# Altium project RFSoC-AMC.PrjPCB (part 5 of 22)

## Sheet RTM_Connector.SchDoc: RFSoC AMC
size 420 x 297 mm; CompanyName: WUT; DrawnBy: T. Przywozki; Organization: WUT ISE; Address1: Warsaw University of Technology; Address2: Nowowiejska 15/19 00-665 Warsaw; Address3: Tomasz.Przywozki@pw.edu.pl; DocumentNumber: 26; Revision: 1; SheetNumber: 26; SheetTotal: 45; Project: RFSoC AMC; ModifiedBy: T. Przywozki; CreateDate: -; CheckedDate: -; DivGrp: ISE; Designer: T. Przywozki; ModifiedDate: -; ProjectName: ADC/DAC MEZZANINE
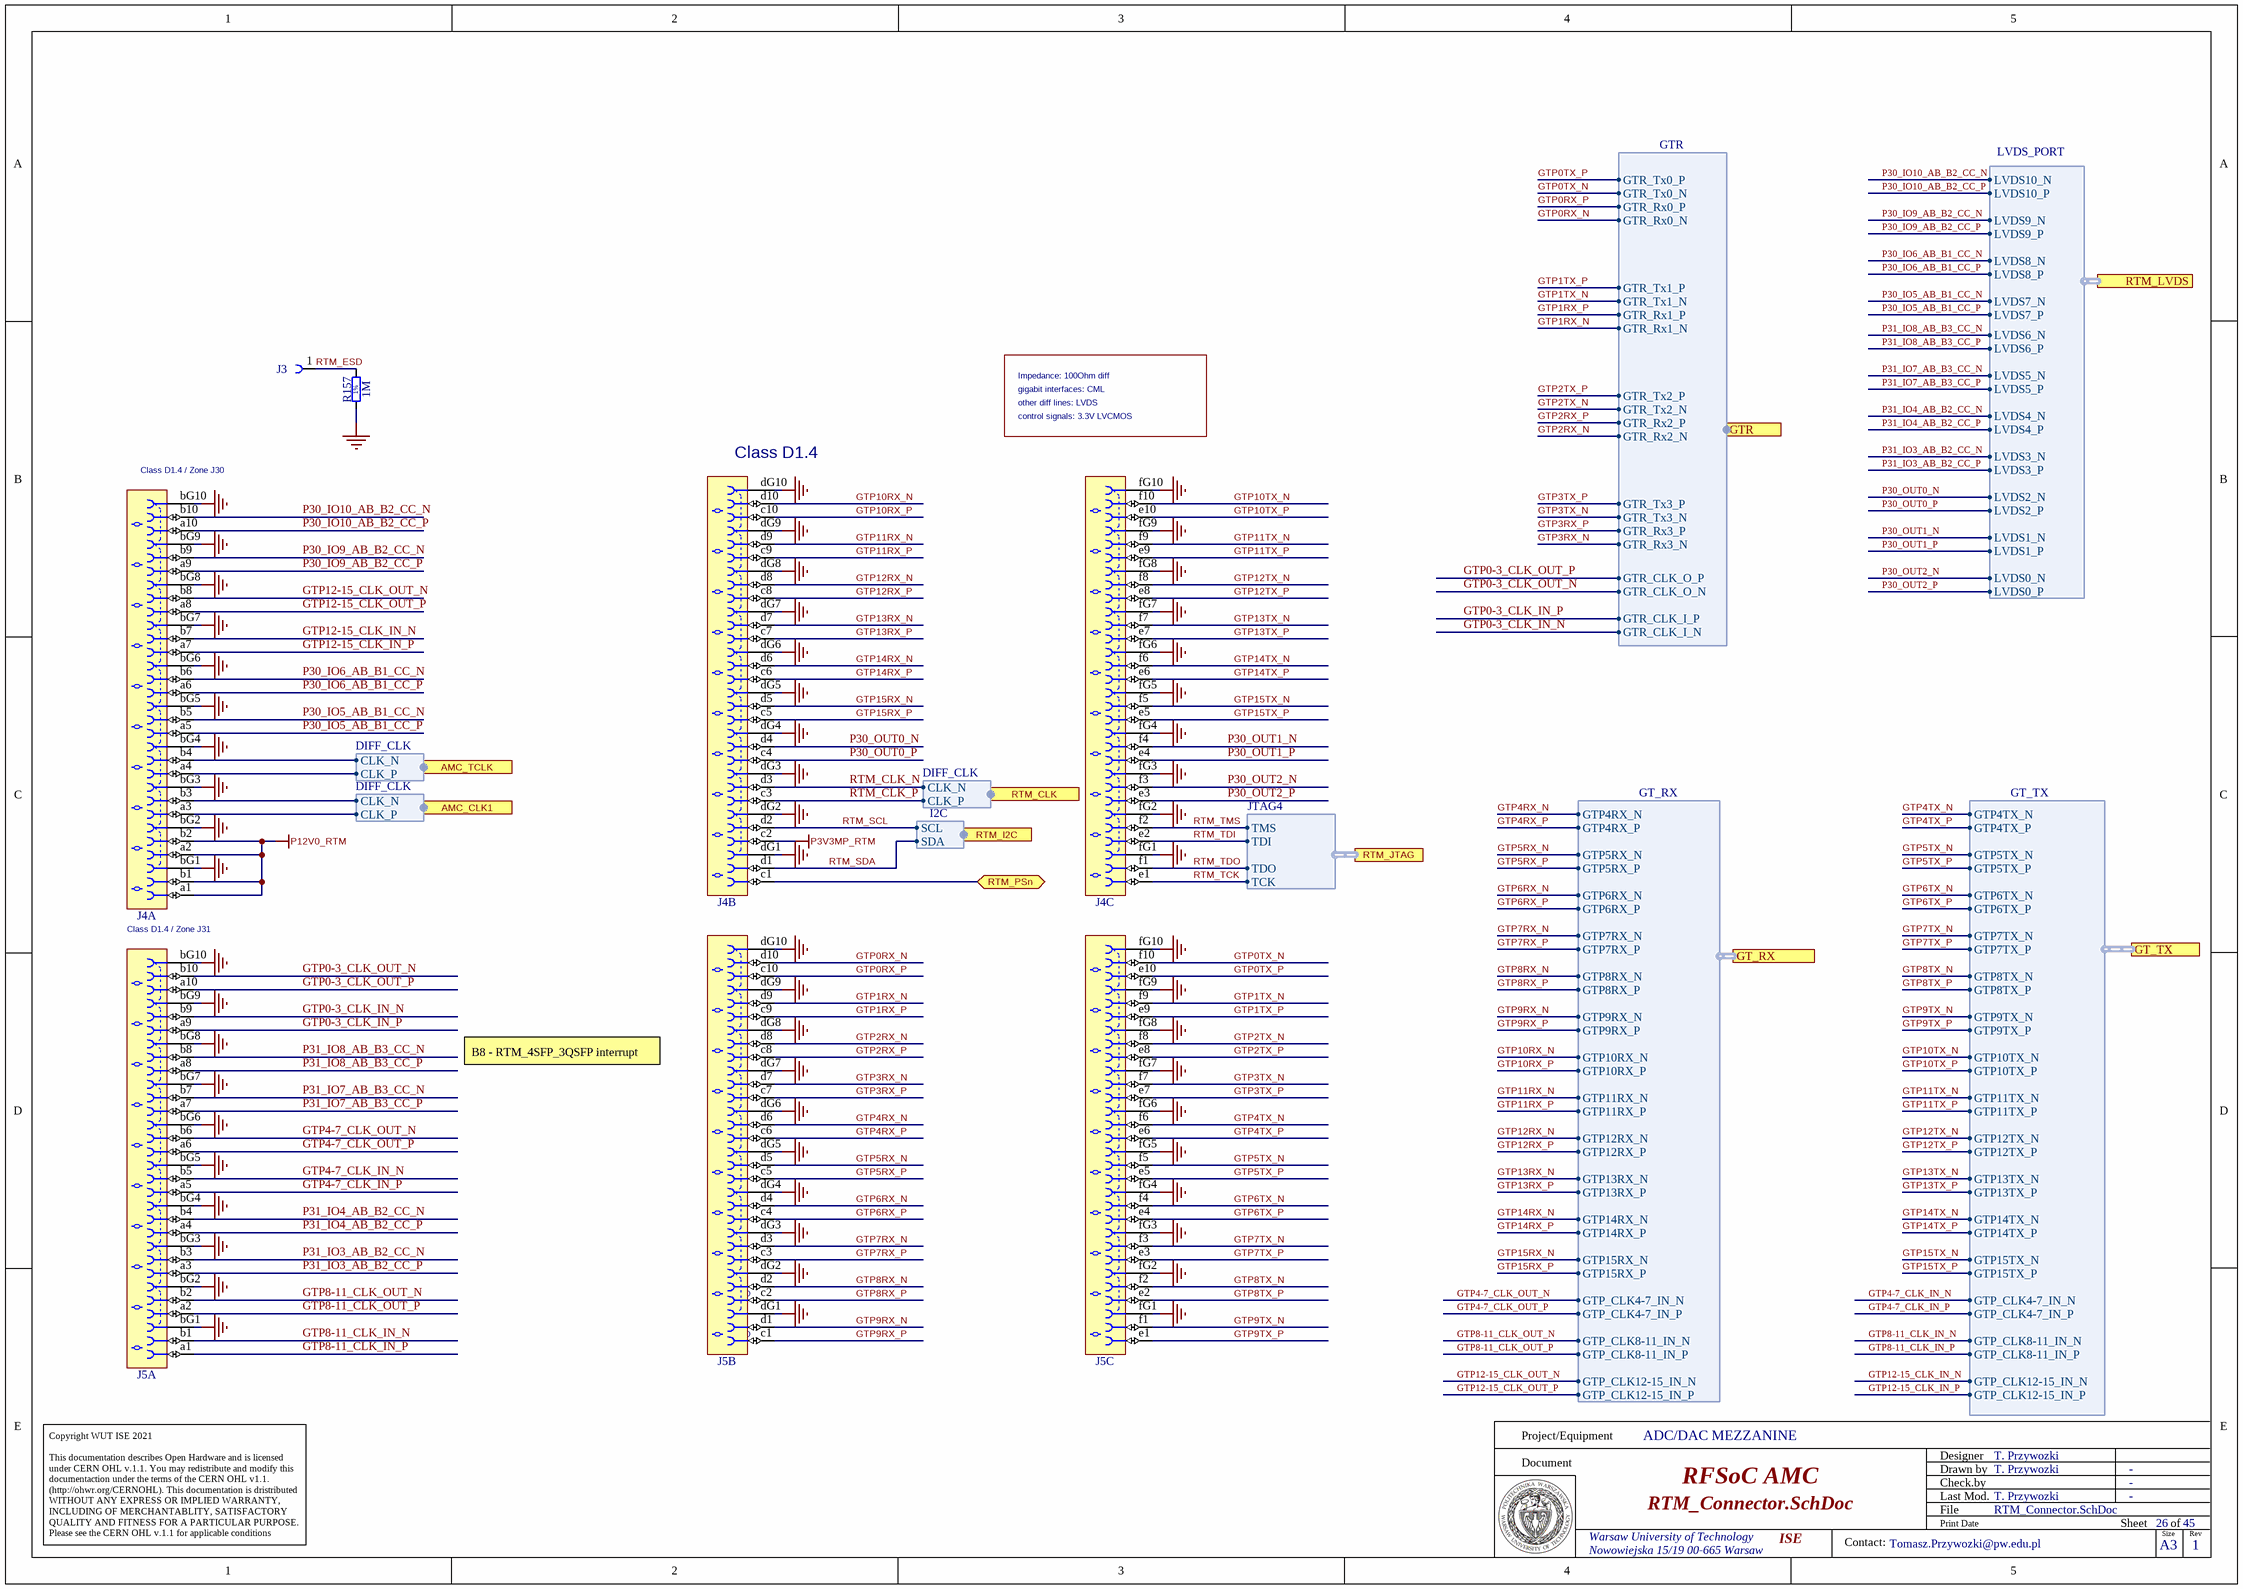
[diagram p9: RTM_Connector.SchDoc]

### Parts
J3  (no value)  [TYCO_5120913-1]
J4  Advanced TCA  [TYCO_6469081-1]  (value not drawn)  (parts A,B,C of 3)
J5  Advanced TCA  [TYCO_6469081-1]  (value not drawn)  (parts A,B,C of 3)
R157  1M  [RESC5025X65N]

### Ports
AMC_CLK1 (harness DIFF_CLK), AMC_TCLK (harness DIFF_CLK), GT_RX (harness GT_RX), GT_TX (harness GT_TX), GTR (harness GTR), RTM_CLK (harness DIFF_CLK), RTM_I2C (harness I2C), RTM_JTAG (harness JTAG4), RTM_LVDS (harness LVDS_PORT), RTM_PSn (bidir)

### Harnesses
LVDS_PORT: LVDS0_P, LVDS0_N, LVDS1_P, LVDS1_N, LVDS2_P, LVDS2_N, LVDS3_P, LVDS3_N, LVDS4_P, LVDS4_N, LVDS5_P, LVDS5_N, LVDS6_P, LVDS6_N, LVDS7_P, LVDS7_N, LVDS8_P, LVDS8_N, LVDS9_P, LVDS9_N, LVDS10_P, LVDS10_N
GT_RX: GTP4RX_P, GTP5RX_N, GTP4RX_N, GTP5RX_P, GTP6RX_N, GTP6RX_P, GTP7RX_N, GTP7RX_P, GTP8RX_N, GTP8RX_P, GTP9RX_N, GTP9RX_P, GTP10RX_N, GTP10RX_P, GTP11RX_N, GTP11RX_P, GTP12RX_N, GTP12RX_P, GTP13RX_N, GTP13RX_P, GTP14RX_N, GTP14RX_P, GTP15RX_N, GTP15RX_P, GTP_CLK4-7_IN_N, GTP_CLK8-11_IN_N, GTP_CLK4-7_IN_P, GTP_CLK8-11_IN_P, GTP_CLK12-15_IN_N, GTP_CLK12-15_IN_P
GT_TX: GTP4TX_N, GTP4TX_P, GTP5TX_N, GTP5TX_P, GTP6TX_N, GTP6TX_P, GTP7TX_N, GTP7TX_P, GTP8TX_N, GTP8TX_P, GTP9TX_N, GTP9TX_P, GTP10TX_N, GTP10TX_P, GTP11TX_N, GTP11TX_P, GTP12TX_N, GTP12TX_P, GTP13TX_N, GTP13TX_P, GTP14TX_N, GTP14TX_P, GTP15TX_N, GTP15TX_P, GTP_CLK4-7_IN_N, GTP_CLK8-11_IN_N, GTP_CLK4-7_IN_P, GTP_CLK8-11_IN_P, GTP_CLK12-15_IN_N, GTP_CLK12-15_IN_P
JTAG4: TMS, TDI, TDO, TCK
I2C: SCL, SDA
DIFF_CLK: CLK_P, CLK_N
GTR: GTR_Tx0_P, GTR_Tx0_N, GTR_Rx0_P, GTR_Rx0_N, GTR_Rx1_P, GTR_Rx1_N, GTR_Tx1_P, GTR_Tx1_N, GTR_Rx2_P, GTR_Rx2_N, GTR_Tx2_P, GTR_Tx2_N, GTR_Rx3_P, GTR_Rx3_N, GTR_Tx3_P, GTR_Tx3_N, GTR_CLK_O_P, GTR_CLK_O_N, GTR_CLK_I_P, GTR_CLK_I_N

### Nets
GND: J4.bG1 J4.bG2 J4.bG3 J4.bG4 J4.bG5 J4.bG6 J4.bG7 J4.bG8 J4.bG9 J4.bG10 J4.dG1 J4.dG2 J4.dG3 J4.dG4 J4.dG5 J4.dG6 J4.dG7 J4.dG8 J4.dG9 J4.dG10 J4.fG1 J4.fG2 J4.fG3 J4.fG4 J4.fG5 J4.fG6 J4.fG7 J4.fG8 J4.fG9 J4.fG10 J5.bG1 J5.bG2 J5.bG3 J5.bG4 J5.bG5 J5.bG6 J5.bG7 J5.bG8 J5.bG9 J5.bG10 J5.dG1 J5.dG2 J5.dG3 J5.dG4 J5.dG5 J5.dG6 J5.dG7 J5.dG8 J5.dG9 J5.dG10 J5.fG1 J5.fG2 J5.fG3 J5.fG4 J5.fG5 J5.fG6 J5.fG7 J5.fG8 J5.fG9 J5.fG10 R157.1
P3V3MP_RTM: J4.c2
P12V0_RTM: J4.a1 J4.a2 J4.b1 J4.b2
AMC_CLK_N: J4.b3 ; port AMC_CLK1.CLK_N
AMC_CLK_P: J4.a3 ; port AMC_CLK1.CLK_P
AMC_TCLKA_N: J4.b4 ; port AMC_TCLK.CLK_N
AMC_TCLKA_P: J4.a4 ; port AMC_TCLK.CLK_P
GTP0-3_CLK_IN_N: J5.b9 ; port GTR.GTR_CLK_I_N
GTP0-3_CLK_IN_P: J5.a9 ; port GTR.GTR_CLK_I_P
GTP0-3_CLK_OUT_N: J5.b10 ; port GTR.GTR_CLK_O_N
GTP0-3_CLK_OUT_P: J5.a10 ; port GTR.GTR_CLK_O_P
GTP0RX_N: J5.d10 ; port GTR.GTR_Rx0_N
GTP0RX_P: J5.c10 ; port GTR.GTR_Rx0_P
GTP0TX_N: J5.f10 ; port GTR.GTR_Tx0_N
GTP0TX_P: J5.e10 ; port GTR.GTR_Tx0_P
GTP1RX_N: J5.d9 ; port GTR.GTR_Rx1_N
GTP1RX_P: J5.c9 ; port GTR.GTR_Rx1_P
GTP1TX_N: J5.f9 ; port GTR.GTR_Tx1_N
GTP1TX_P: J5.e9 ; port GTR.GTR_Tx1_P
GTP2RX_N: J5.d8 ; port GTR.GTR_Rx2_N
GTP2RX_P: J5.c8 ; port GTR.GTR_Rx2_P
GTP2TX_N: J5.f8 ; port GTR.GTR_Tx2_N
GTP2TX_P: J5.e8 ; port GTR.GTR_Tx2_P
GTP3RX_N: J5.d7 ; port GTR.GTR_Rx3_N
GTP3RX_P: J5.c7 ; port GTR.GTR_Rx3_P
GTP3TX_N: J5.f7 ; port GTR.GTR_Tx3_N
GTP3TX_P: J5.e7 ; port GTR.GTR_Tx3_P
GTP4-7_CLK_IN_N: J5.b5 ; port GT_TX.GTP_CLK4-7_IN_N
GTP4-7_CLK_IN_P: J5.a5 ; port GT_TX.GTP_CLK4-7_IN_P
GTP4-7_CLK_OUT_N: J5.b6 ; port GT_RX.GTP_CLK4-7_IN_N
GTP4-7_CLK_OUT_P: J5.a6 ; port GT_RX.GTP_CLK4-7_IN_P
GTP4RX_N: J5.d6 ; port GT_RX.GTP4RX_N
GTP4RX_P: J5.c6 ; port GT_RX.GTP4RX_P
GTP4TX_N: J5.f6 ; port GT_TX.GTP4TX_N
GTP4TX_P: J5.e6 ; port GT_TX.GTP4TX_P
GTP5RX_N: J5.d5 ; port GT_RX.GTP5RX_N
GTP5RX_P: J5.c5 ; port GT_RX.GTP5RX_P
GTP5TX_N: J5.f5 ; port GT_TX.GTP5TX_N
GTP5TX_P: J5.e5 ; port GT_TX.GTP5TX_P
GTP6RX_N: J5.d4 ; port GT_RX.GTP6RX_N
GTP6RX_P: J5.c4 ; port GT_RX.GTP6RX_P
GTP6TX_N: J5.f4 ; port GT_TX.GTP6TX_N
GTP6TX_P: J5.e4 ; port GT_TX.GTP6TX_P
GTP7RX_N: J5.d3 ; port GT_RX.GTP7RX_N
GTP7RX_P: J5.c3 ; port GT_RX.GTP7RX_P
GTP7TX_N: J5.f3 ; port GT_TX.GTP7TX_N
GTP7TX_P: J5.e3 ; port GT_TX.GTP7TX_P
GTP8-11_CLK_IN_N: J5.b1 ; port GT_TX.GTP_CLK8-11_IN_N
GTP8-11_CLK_IN_P: J5.a1 ; port GT_TX.GTP_CLK8-11_IN_P
GTP8-11_CLK_OUT_N: J5.b2 ; port GT_RX.GTP_CLK8-11_IN_N
GTP8-11_CLK_OUT_P: J5.a2 ; port GT_RX.GTP_CLK8-11_IN_P
GTP8RX_N: J5.d2 ; port GT_RX.GTP8RX_N
GTP8RX_P: J5.c2 ; port GT_RX.GTP8RX_P
GTP8TX_N: J5.f2 ; port GT_TX.GTP8TX_N
GTP8TX_P: J5.e2 ; port GT_TX.GTP8TX_P
GTP9RX_N: J5.d1 ; port GT_RX.GTP9RX_N
GTP9RX_P: J5.c1 ; port GT_RX.GTP9RX_P
GTP9TX_N: J5.f1 ; port GT_TX.GTP9TX_N
GTP9TX_P: J5.e1 ; port GT_TX.GTP9TX_P
GTP10RX_N: J4.d10 ; port GT_RX.GTP10RX_N
GTP10RX_P: J4.c10 ; port GT_RX.GTP10RX_P
GTP10TX_N: J4.f10 ; port GT_TX.GTP10TX_N
GTP10TX_P: J4.e10 ; port GT_TX.GTP10TX_P
GTP11RX_N: J4.d9 ; port GT_RX.GTP11RX_N
GTP11RX_P: J4.c9 ; port GT_RX.GTP11RX_P
GTP11TX_N: J4.f9 ; port GT_TX.GTP11TX_N
GTP11TX_P: J4.e9 ; port GT_TX.GTP11TX_P
GTP12-15_CLK_IN_N: J4.b7 ; port GT_TX.GTP_CLK12-15_IN_N
GTP12-15_CLK_IN_P: J4.a7 ; port GT_TX.GTP_CLK12-15_IN_P
GTP12-15_CLK_OUT_N: J4.b8 ; port GT_RX.GTP_CLK12-15_IN_N
GTP12-15_CLK_OUT_P: J4.a8 ; port GT_RX.GTP_CLK12-15_IN_P
GTP12RX_N: J4.d8 ; port GT_RX.GTP12RX_N
GTP12RX_P: J4.c8 ; port GT_RX.GTP12RX_P
GTP12TX_N: J4.f8 ; port GT_TX.GTP12TX_N
GTP12TX_P: J4.e8 ; port GT_TX.GTP12TX_P
GTP13RX_N: J4.d7 ; port GT_RX.GTP13RX_N
GTP13RX_P: J4.c7 ; port GT_RX.GTP13RX_P
GTP13TX_N: J4.f7 ; port GT_TX.GTP13TX_N
GTP13TX_P: J4.e7 ; port GT_TX.GTP13TX_P
GTP14RX_N: J4.d6 ; port GT_RX.GTP14RX_N
GTP14RX_P: J4.c6 ; port GT_RX.GTP14RX_P
GTP14TX_N: J4.f6 ; port GT_TX.GTP14TX_N
GTP14TX_P: J4.e6 ; port GT_TX.GTP14TX_P
GTP15RX_N: J4.d5 ; port GT_RX.GTP15RX_N
GTP15RX_P: J4.c5 ; port GT_RX.GTP15RX_P
GTP15TX_N: J4.f5 ; port GT_TX.GTP15TX_N
GTP15TX_P: J4.e5 ; port GT_TX.GTP15TX_P
P30_IO5_AB_B1_CC_N: J4.b5 ; port RTM_LVDS.LVDS7_N  [project net LVDS7_N]
P30_IO5_AB_B1_CC_P: J4.a5 ; port RTM_LVDS.LVDS7_P  [project net LVDS7_P]
P30_IO6_AB_B1_CC_N: J4.b6 ; port RTM_LVDS.LVDS8_N  [project net LVDS8_N]
P30_IO6_AB_B1_CC_P: J4.a6 ; port RTM_LVDS.LVDS8_P  [project net LVDS8_P]
P30_IO9_AB_B2_CC_N: J4.b9 ; port RTM_LVDS.LVDS9_N  [project net LVDS9_N]
P30_IO9_AB_B2_CC_P: J4.a9 ; port RTM_LVDS.LVDS9_P  [project net LVDS9_P]
P30_IO10_AB_B2_CC_N: J4.b10 ; port RTM_LVDS.LVDS10_N  [project net LVDS10_N]
P30_IO10_AB_B2_CC_P: J4.a10 ; port RTM_LVDS.LVDS10_P  [project net LVDS10_P]
P30_OUT0_N: J4.d4 ; port RTM_LVDS.LVDS2_N  [project net LVDS2_N]
P30_OUT0_P: J4.c4 ; port RTM_LVDS.LVDS2_P  [project net LVDS2_P]
P30_OUT1_N: J4.f4 ; port RTM_LVDS.LVDS1_N  [project net LVDS1_N]
P30_OUT1_P: J4.e4 ; port RTM_LVDS.LVDS1_P  [project net LVDS1_P]
P30_OUT2_N: J4.f3 ; port RTM_LVDS.LVDS0_N  [project net LVDS0_N]
P30_OUT2_P: J4.e3 ; port RTM_LVDS.LVDS0_P  [project net LVDS0_P]
P31_IO3_AB_B2_CC_N: J5.b3 ; port RTM_LVDS.LVDS3_N  [project net LVDS3_N]
P31_IO3_AB_B2_CC_P: J5.a3 ; port RTM_LVDS.LVDS3_P  [project net LVDS3_P]
P31_IO4_AB_B2_CC_N: J5.b4 ; port RTM_LVDS.LVDS4_N  [project net LVDS4_N]
P31_IO4_AB_B2_CC_P: J5.a4 ; port RTM_LVDS.LVDS4_P  [project net LVDS4_P]
P31_IO7_AB_B3_CC_N: J5.b7 ; port RTM_LVDS.LVDS5_N  [project net LVDS5_N]
P31_IO7_AB_B3_CC_P: J5.a7 ; port RTM_LVDS.LVDS5_P  [project net LVDS5_P]
P31_IO8_AB_B3_CC_N: J5.b8 ; port RTM_LVDS.LVDS6_N  [project net LVDS6_N]
P31_IO8_AB_B3_CC_P: J5.a8 ; port RTM_LVDS.LVDS6_P  [project net LVDS6_P]
RTM_CLK_N: J4.d3 ; port RTM_CLK.CLK_N
RTM_CLK_P: J4.c3 ; port RTM_CLK.CLK_P
RTM_ESD: J3.1 R157.2
RTM_SCL: J4.d2 ; port RTM_I2C.SCL
RTM_SDA: J4.d1 ; port RTM_I2C.SDA
RTM_TCK: J4.e1 ; port RTM_JTAG.TCK
RTM_TDI: J4.e2 ; port RTM_JTAG.TDI
RTM_TDO: J4.f1 ; port RTM_JTAG.TDO
RTM_TMS: J4.f2 ; port RTM_JTAG.TMS
NetD6_1: J4.c1 ; port RTM_PSn

### Notes on the sheet
- gigabit interfaces: CML
- Impedance: 100Ohm diff
- (near J4) Class D1.4
- other diff lines: LVDS
- control signals: 3.3V LVCMOS
- (near J4) Class D1.4 / Zone J30
- Class D1.4 / Zone J31
- B8 - RTM_4SFP_3QSFP interrupt
- (near J5) NOT USED
- Project/Equipment
- Document
- Designer
- Drawn by
- Check.by
- Copyright WUT ISE 2021
  This documentation describes Open Hardware and is licensed under CERN OHL v.1.1. You may redistribute and modify this documentaction under the terms of the CERN OHL v1.1.
  (http://ohwr.org/CERNOHL). This documentation is dristributed WITHOUT ANY EXPRESS OR IMPLIED WARRANTY, INCLUDING OF MERCHANTABLITY, SATISFACTORY QUALITY AND FITNESS FOR A PARTICULAR PURPOSE. Please see the CERN OHL v.1.1 for applicable conditions
- File
- Last Mod.
- Print Date
- Sheet
- Size
- A3
- of
- Rev
- Contact:
- (in symbol R2010_1M_1%_0.5W_200PPM) 1%

### Library data of the parts
J3 = TYCO_5120913-1: Single Pin Female; Manufacturer: TYCO ELECTRONICS; Part Description: Universal Right Angle Female Power Module Guide (keyed); PressFit: No; Manufacturer Part Number: 5120913-1; Part Number: TYCO_5120913-1; Component Kind: Standard; Component Type: Standard; Pin Count: 1; Mounted: Yes; Socket: No; SMD: No; Sense: No; Status: None; ComponentHeight: 9.78mm; HelpURL: \\cern.ch\dfs\Applications\Altium\Datasheets\TYCO_5120913-1.pdf; Author: CERN DEM JLC; CreateDate: 28/08/2013; LatestRevisionDate: 28/08/2013
J4 J5 = TYCO_6469081-1: Connector 60 ATCA Female 30 Pairs (60 Signals) + 3x10 Ground; Manufacturer: TYCO ELECTRONICS; Part Description: 60 Positions, Pitch 2.5mm,  Advanced TCA, Z-PACK HM-Zd Right Angle Press Fit Receptacle; Manufacturer Part Number: 6469081-1; Part Number: TYCO_6469081-1; Component Kind: Standard; Component Type: Standard; Pin Count: 90; Family: Advanced TCA; Mounted: Yes; Socket: No; SMD: No; PressFit: Yes; Sense: No; Status: None; ComponentHeight: 12.18mm; HelpURL: \\cern.ch\dfs\Applications\Altium\Datasheets\TYCO_6469081-1.pdf; Author: CERN DEM JLC; CreateDate: 28/08/2013; LatestRevisionDate: 28/08/2013
R157 = R2010_1M_1%_0.5W_200PPM: Resistor - 1%; Manufacturer: GENERIC; Part Description: Thick Film Chip Resistor; Manufacturer1 Part Number: LHVC2010-1MFT4; Power: 0.5W; TC: ±200ppm/°C; PressFit: No; Manufacturer Part Number: R2010_1M_1%_0.5W_200PPM; Part Number: R2010_1M_1%_0.5W_200PPM; Tolerance: ±1%; Value: 1M; Component Kind: Standard; Component Type: Standard; Pin Count: 2; Status: None; Case: 2010; Mounted: Yes; Sense: No; Socket: No; SMD: Yes; Manufacturer1 Example: TT WELWYN; Manufacturer1 ComponentHeight: 0.65mm; HelpURL: \\cern.ch\dfs\Applications\Altium\Datasheets\R2010_WELWYN_LHVC.pdf; Author: CERN DEM JLC; CreateDate: 26/02/2015; LatestRevisionDate: 26/02/2015

## Sheet ETH_PHY_SW_L2L3.SchDoc: RFSoC AMC
size 420 x 297 mm; CompanyName: WUT; DrawnBy: T. Przywozki; Organization: WUT ISE; Address1: Warsaw University of Technology; Address2: Nowowiejska 15/19 00-665 Warsaw; Address3: Tomasz.Przywozki@pw.edu.pl; DocumentNumber: 25; Revision: 1; SheetNumber: 25; SheetTotal: 45; Project: RFSoC AMC; ModifiedBy: T. Przywozki; CreateDate: -; CheckedDate: -; DivGrp: ISE; Designer: T. Przywozki; ModifiedDate: -; ProjectName: ADC/DAC MEZZANINE
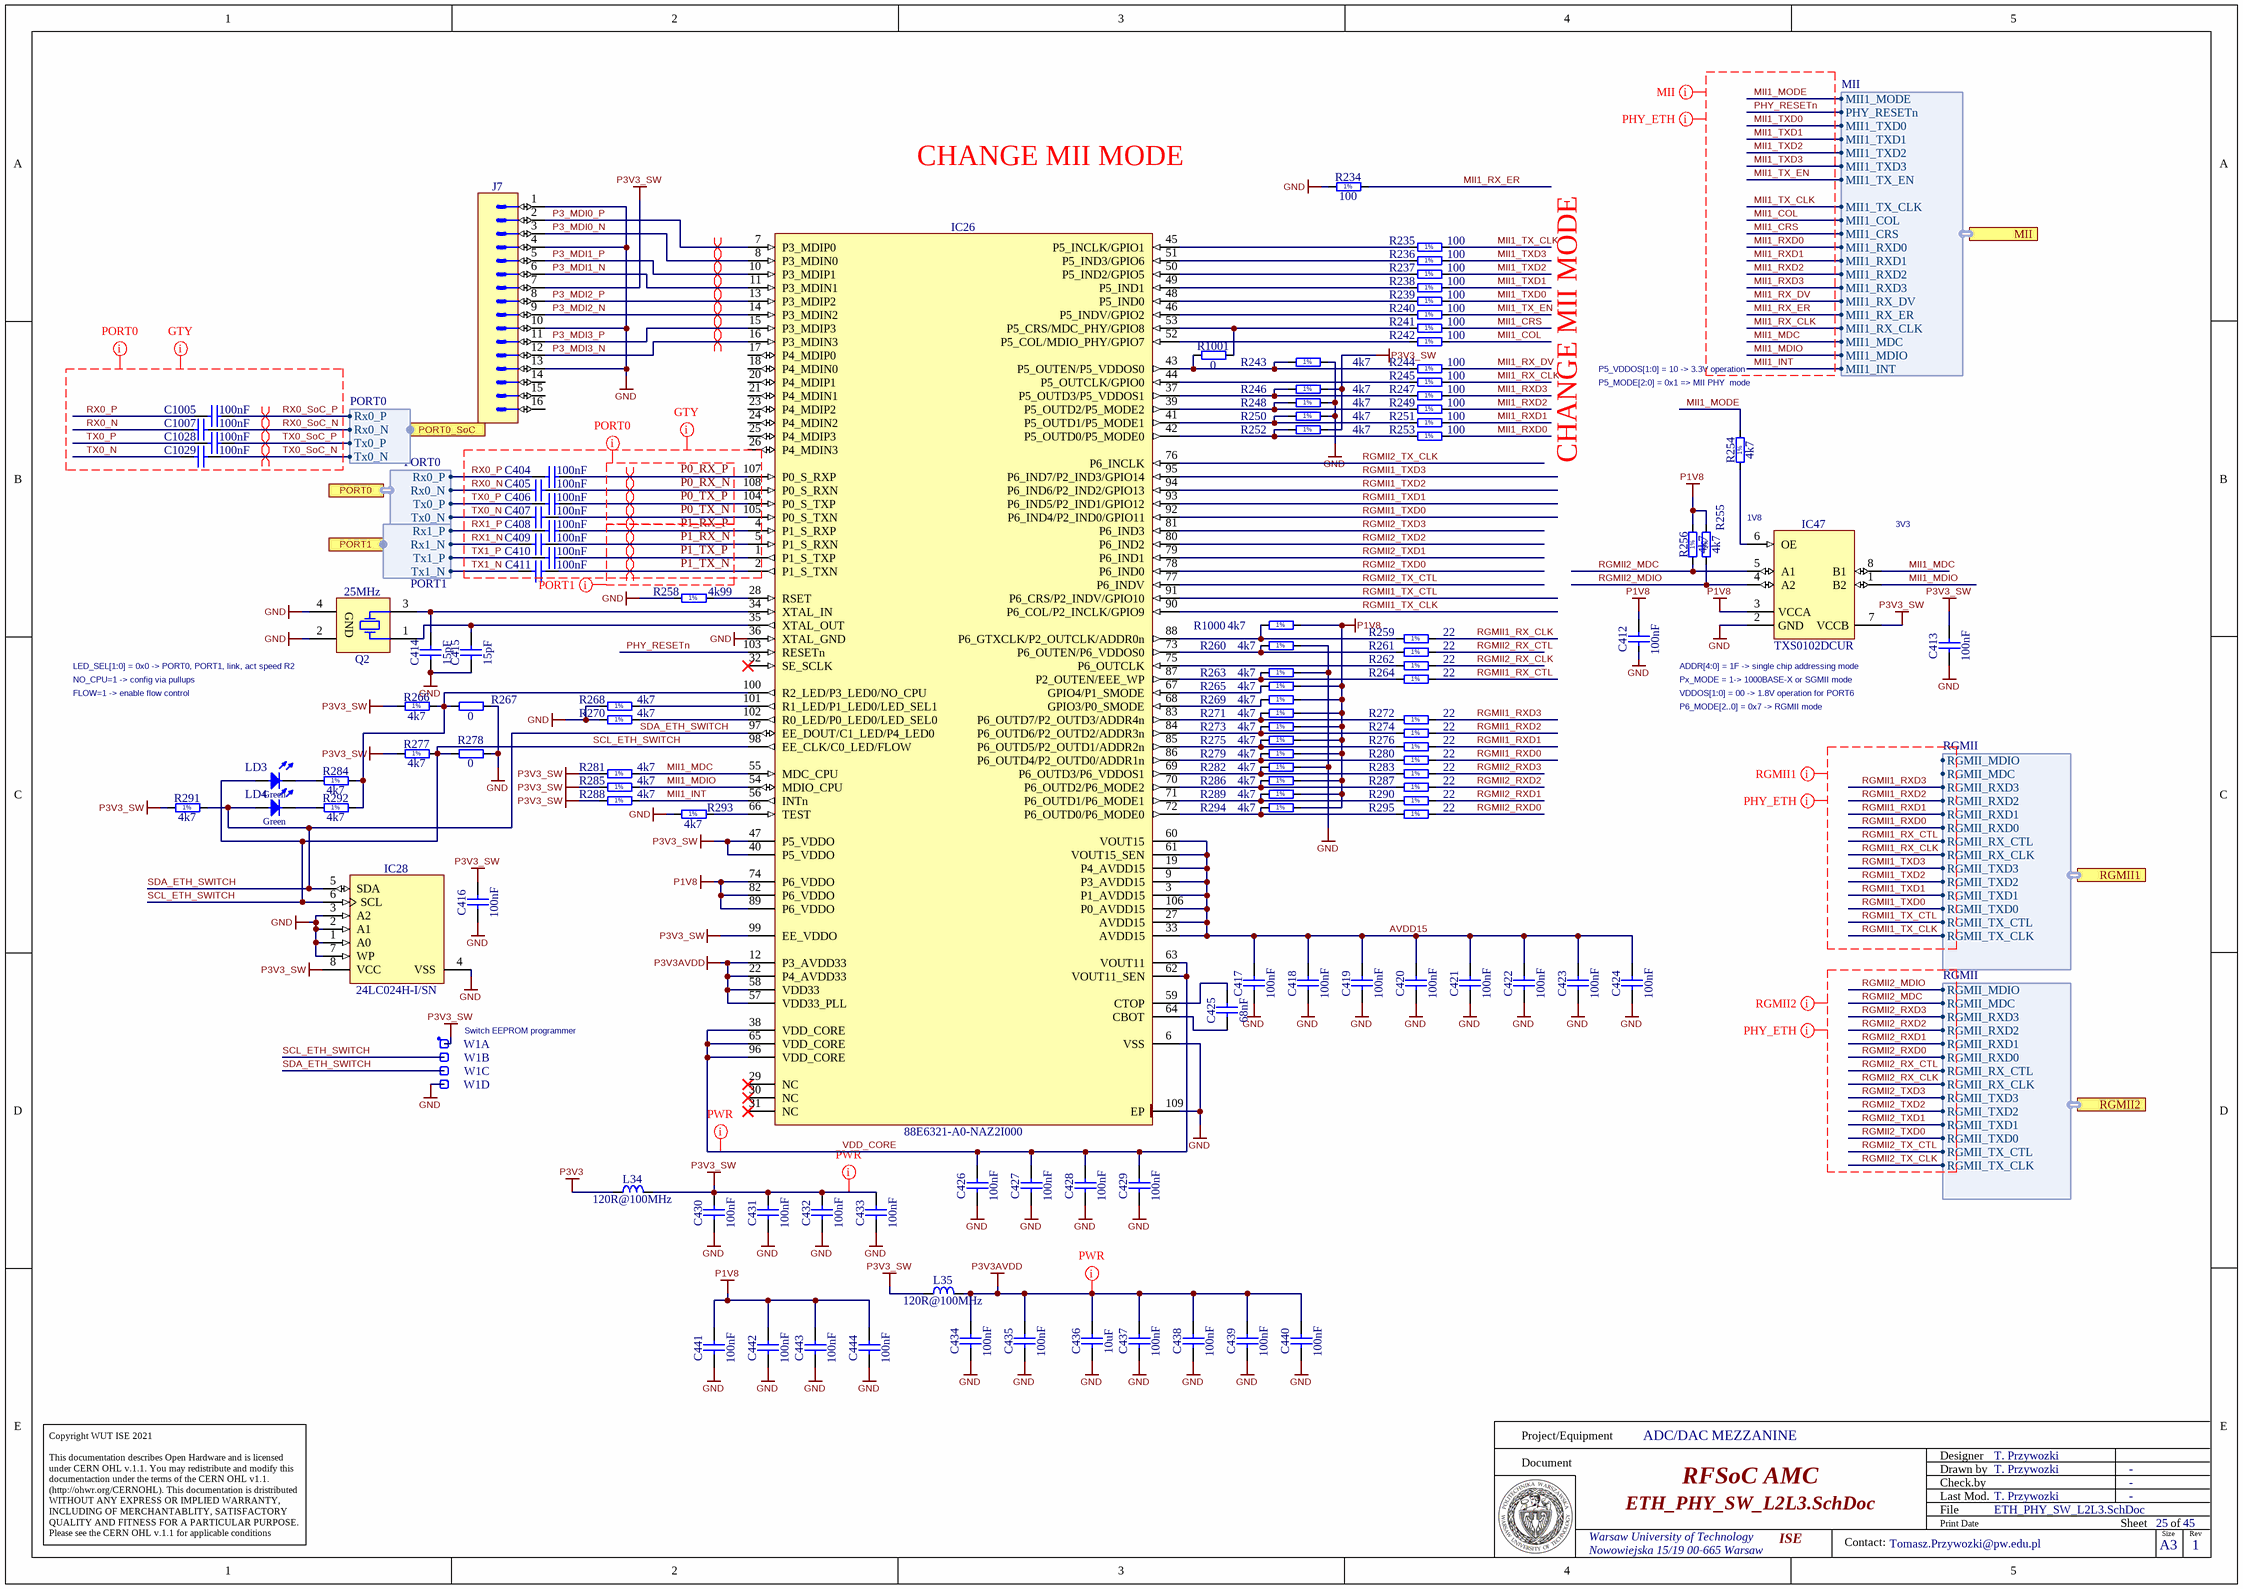
[diagram p10: ETH_PHY_SW_L2L3.SchDoc]

### Parts
C404  100nF  [CAPC0603X33N]
C405  100nF  [CAPC0603X33N]
C406  100nF  [CAPC0603X33N]
C407  100nF  [CAPC0603X33N]
C408  100nF  [CAPC0603X33N]
C409  100nF  [CAPC0603X33N]
C410  100nF  [CAPC0603X33N]
C411  100nF  [CAPC0603X33N]
C412  100nF  [CAPC0603X33N]
C413  100nF  [CAPC0603X33N]
C414  15pF  [CAPC1005X55N]
C415  15pF  [CAPC1005X55N]
C416  100nF  [CAPC0603X33N]
C417  100nF  [CAPC0603X33N]
C418  100nF  [CAPC0603X33N]
C419  100nF  [CAPC0603X33N]
C420  100nF  [CAPC0603X33N]
C421  100nF  [CAPC0603X33N]
C422  100nF  [CAPC0603X33N]
C423  100nF  [CAPC0603X33N]
C424  100nF  [CAPC0603X33N]
C425  68nF  [CAPC1005X55N]
C426  100nF  [CAPC0603X33N]
C427  100nF  [CAPC0603X33N]
C428  100nF  [CAPC0603X33N]
C429  100nF  [CAPC0603X33N]
C430  100nF  [CAPC0603X33N]
C431  100nF  [CAPC0603X33N]
C432  100nF  [CAPC0603X33N]
C433  100nF  [CAPC0603X33N]
C434  100nF  [CAPC0603X33N]
C435  100nF  [CAPC0603X33N]
C436  10uF  [CAPC1608X87N]
C437  100nF  [CAPC0603X33N]
C438  100nF  [CAPC0603X33N]
C439  100nF  [CAPC0603X33N]
C440  100nF  [CAPC0603X33N]
C441  100nF  [CAPC0603X33N]
C442  100nF  [CAPC0603X33N]
C443  100nF  [CAPC0603X33N]
C444  100nF  [CAPC0603X33N]
C1005  100nF  [CAPC0603X33N]
C1007  100nF  [CAPC0603X33N]
C1028  100nF  [CAPC0603X33N]
C1029  100nF  [CAPC0603X33N]
IC26  88E6321-A0-NAZ2I000  [QFN40P1200X1200X90-109N-S475]
IC28  24LC024H-I/SN  [SOIC127P600X175-8N]
IC47  TXS0102DCUR  [SOP50P310X90-8N]
J7  Milli-Grid™  [MOLEX_87759-1650]  (value not drawn)
L34  120R@100MHz  [INDC1608X65N]
L35  120R@100MHz  [INDC1608X65N]
LD3  Green  [LED_KINGBRIGHT_KPH-1608CGCK]
LD4  Green  [LED_KINGBRIGHT_KPH-1608CGCK]
Q2  25MHz  [XTAL_TXC_8Y]
R234  100  [RESC0603X28N]
R235  100  [RESC0603X28N]
R236  100  [RESC0603X28N]
R237  100  [RESC0603X28N]
R238  100  [RESC0603X28N]
R239  100  [RESC0603X28N]
R240  100  [RESC0603X28N]
R241  100  [RESC0603X28N]
R242  100  [RESC0603X28N]
R243  4k7  [RESC1005X40N]
R244  100  [RESC0603X28N]
R245  100  [RESC0603X28N]
R246  4k7  [RESC1005X40N]
R247  100  [RESC0603X28N]
R248  4k7  [RESC1005X40N]
R249  100  [RESC0603X28N]
R250  4k7  [RESC1005X40N]
R251  100  [RESC0603X28N]
R252  4k7  [RESC1005X40N]
R253  100  [RESC0603X28N]
R254  4k7  [RESC1005X40N]
R255  4k7  [RESC1005X40N]
R256  4k7  [RESC1005X40N]
R258  4k99  [RESC1608X55N]
R259  22  [RESC1005X40N]
R260  4k7  [RESC1005X40N]
R261  22  [RESC1005X40N]
R262  22  [RESC1005X40N]
R263  4k7  [RESC1005X40N]
R264  22  [RESC1005X40N]
R265  4k7  [RESC1005X40N]
R266  4k7  [RESC1005X40N]
R267  0  [RESC1005X40N]
R268  4k7  [RESC1005X40N]
R269  4k7  [RESC1005X40N]
R270  4k7  [RESC1005X40N]
R271  4k7  [RESC1005X40N]
R272  22  [RESC1005X40N]
R273  4k7  [RESC1005X40N]
R274  22  [RESC1005X40N]
R275  4k7  [RESC1005X40N]
R276  22  [RESC1005X40N]
R277  4k7  [RESC1005X40N]
R278  0  [RESC1005X40N]
R279  4k7  [RESC1005X40N]
R280  22  [RESC1005X40N]
R281  4k7  [RESC1005X40N]
R282  4k7  [RESC1005X40N]
R283  22  [RESC1005X40N]
R284  4k7  [RESC1005X40N]
R285  4k7  [RESC1005X40N]
R286  4k7  [RESC1005X40N]
R287  22  [RESC1005X40N]
R288  4k7  [RESC1005X40N]
R289  4k7  [RESC1005X40N]
R290  22  [RESC1005X40N]
R291  4k7  [RESC1005X40N]
R292  4k7  [RESC1005X40N]
R293  4k7  [RESC1005X40N]
R294  4k7  [RESC1005X40N]
R295  22  [RESC1005X40N]
R1000  4k7  [RESC1005X40N]
R1001  0  [RESC1005X40N]
W1  Header 4  [SAMTEC_MTLW-104-07-L-S-250]  (value not drawn)  (parts A,B,C,D of 4)

### Ports
MII (harness MII), PORT0 (harness PORT0), PORT0_SoC (harness PORT0), PORT1 (harness PORT1), RGMII1 (harness RGMII), RGMII2 (harness RGMII)

### Harnesses
RGMII: RGMII_TX_CLK, RGMII_TX_CTL, RGMII_TXD0, RGMII_TXD1, RGMII_TXD2, RGMII_TXD3, RGMII_RX_CTL, RGMII_RX_CLK, RGMII_RXD0, RGMII_RXD1, RGMII_RXD2, RGMII_RXD3, RGMII_MDC, RGMII_MDIO
MII: MII1_MODE, MII1_TXD0, MII1_TXD2, MII1_TXD3, MII1_TX_EN, MII1_TX_CLK, MII1_COL, MII1_CRS, MII1_RXD0, MII1_RXD1, MII1_RXD2, MII1_RXD3, MII1_RX_DV, MII1_RX_ER, MII1_RX_CLK, MII1_MDC, MII1_MDIO, MII1_INT, PHY_RESETn, MII1_TXD1
PORT1: Rx1_P, Rx1_N, Tx1_N, Tx1_P
PORT0: Rx0_P, Rx0_N, Tx0_N, Tx0_P

### Nets
GND: C412.1 C413.1 C414.1 C415.1 C416.1 C417.1 C418.1 C419.1 C420.1 C421.1 C422.1 C423.1 C424.1 C426.1 C427.1 C428.1 C429.1 C430.1 C431.1 C432.1 C433.1 C434.1 C435.1 C436.1 C437.1 C438.1 C439.1 C440.1 C441.1 C442.1 C443.1 C444.1 IC26.6(VSS) IC26.36(XTAL_GND) IC26.109(EP) IC28.1(A0) IC28.2(A1) IC28.3(A2) IC28.4(VSS) IC28.7(WP) IC47.2(GND) J7.1 J7.4 J7.10 J7.13 Q2.2(GND) Q2.4(GND) R234.1 R243.2 R248.2 R250.2 R258.1 R260.2 R263.2 R267.2 R268.1 R270.1 R278.2 R282.2 R293.1 W1.4
P1V8: C412.2 C441.2 C442.2 C443.2 C444.2 IC26.74(P6_VDDO) IC26.82(P6_VDDO) IC26.89(P6_VDDO) IC47.3(Vcca) R255.2 R256.2 R265.2 R269.2 R271.2 R273.2 R275.2 R279.2 R286.2 R289.2 R294.2 R1000.2
P3V3: L34.1
P3V3_SW: C413.2 C416.2 C430.2 C431.2 C432.2 C433.2 IC26.40(P5_VDDO) IC26.47(P5_VDDO) IC26.99(EE_VDDO) IC28.8(VCC) IC47.7(Vccb) J7.7 L34.2 L35.1 R246.2 R252.2 R266.1 R277.1 R281.1 R285.1 R288.1 R291.1 W1.1
P3V3AVDD: C434.2 C435.2 C436.2 C437.2 C438.2 C439.2 C440.2 IC26.12(P3_AVDD33) IC26.22(P4_AVDD33) IC26.57(VDD33_PLL) IC26.58(VDD33) L35.2
AVDD15: C417.2 C418.2 C419.2 C420.2 C421.2 C422.2 C423.2 C424.2 IC26.3(P1_AVDD15) IC26.9(P3_AVDD15) IC26.19(P4_AVDD15) IC26.27(AVDD15) IC26.33(AVDD15) IC26.60(VOUT15) IC26.61(VOUT15_SEN) IC26.106(P0_AVDD15)
MII1_COL: R242.2 ; port MII.MII1_COL
MII1_CRS: R241.2 ; port MII.MII1_CRS
MII1_INT: IC26.56(INTn) R288.2 ; port MII.MII1_INT
MII1_MDC: IC26.55(MDC_CPU) IC47.8(B1) R281.2 ; port MII.MII1_MDC
MII1_MDIO: IC26.54(MDIO_CPU) IC47.1(B2) R285.2 ; port MII.MII1_MDIO
MII1_MODE: R254.2 ; port MII.MII1_MODE
MII1_RX_CLK: R245.2 ; port MII.MII1_RX_CLK
MII1_RX_DV: R244.2 ; port MII.MII1_RX_DV
MII1_RX_ER: R234.2 ; port MII.MII1_RX_ER
MII1_RXD0: R253.2 ; port MII.MII1_RXD0
MII1_RXD1: R251.2 ; port MII.MII1_RXD1
MII1_RXD2: R249.2 ; port MII.MII1_RXD2
MII1_RXD3: R247.2 ; port MII.MII1_RXD3
MII1_TX_CLK: R235.2 ; port MII.MII1_TX_CLK
MII1_TX_EN: R240.2 ; port MII.MII1_TX_EN
MII1_TXD0: R239.2 ; port MII.MII1_TXD0
MII1_TXD1: R238.2 ; port MII.MII1_TXD1
MII1_TXD2: R237.2 ; port MII.MII1_TXD2
MII1_TXD3: R236.2 ; port MII.MII1_TXD3
P0_RX_N: C405.2 IC26.108(P0_S_RXN)
P0_RX_P: C404.2 IC26.107(P0_S_RXP)
P0_TX_N: C407.2 IC26.105(P0_S_TXN)
P0_TX_P: C406.2 IC26.104(P0_S_TXP)
P1_RX_N: C409.2 IC26.5(P1_S_RXN)
P1_RX_P: C408.2 IC26.4(P1_S_RXP)
P1_TX_N: C411.2 IC26.2(P1_S_TXN)
P1_TX_P: C410.2 IC26.1(P1_S_TXP)
P3_MDI0_N: IC26.8(P3_MDIN0) J7.3
P3_MDI0_P: IC26.7(P3_MDIP0) J7.2
P3_MDI1_N: IC26.11(P3_MDIN1) J7.6
P3_MDI1_P: IC26.10(P3_MDIP1) J7.5
P3_MDI2_N: IC26.14(P3_MDIN2) J7.9
P3_MDI2_P: IC26.13(P3_MDIP2) J7.8
P3_MDI3_N: IC26.16(P3_MDIN3) J7.12
P3_MDI3_P: IC26.15(P3_MDIP3) J7.11
PHY_RESETn: IC26.103(RESETn) ; port MII.PHY_RESETn
RGMII1_RX_CLK: R259.2 ; port RGMII1.RGMII_RX_CLK
RGMII1_RX_CTL: R264.2 ; port RGMII1.RGMII_RX_CTL
RGMII1_RXD0: R280.2 ; port RGMII1.RGMII_RXD0
RGMII1_RXD1: R276.2 ; port RGMII1.RGMII_RXD1
RGMII1_RXD2: R274.2 ; port RGMII1.RGMII_RXD2
RGMII1_RXD3: R272.2 ; port RGMII1.RGMII_RXD3
RGMII1_TX_CLK: IC26.90(P6_COL/P2_INCLK/GPIO9) ; port RGMII1.RGMII_TX_CLK
RGMII1_TX_CTL: IC26.91(P6_CRS/P2_INDV/GPIO10) ; port RGMII1.RGMII_TX_CTL
RGMII1_TXD0: IC26.92(P6_IND4/P2_IND0/GPIO11) ; port RGMII1.RGMII_TXD0
RGMII1_TXD1: IC26.93(P6_IND5/P2_IND1/GPIO12) ; port RGMII1.RGMII_TXD1
RGMII1_TXD2: IC26.94(P6_IND6/P2_IND2/GPIO13) ; port RGMII1.RGMII_TXD2
RGMII1_TXD3: IC26.95(P6_IND7/P2_IND3/GPIO14) ; port RGMII1.RGMII_TXD3
RGMII2_MDC: IC47.5(A1) R256.1 ; port RGMII2.RGMII_MDC
RGMII2_MDIO: IC47.4(A2) R255.1 ; port RGMII2.RGMII_MDIO
RGMII2_RX_CLK: R262.2 ; port RGMII2.RGMII_RX_CLK
RGMII2_RX_CTL: R261.2 ; port RGMII2.RGMII_RX_CTL
RGMII2_RXD0: R295.2 ; port RGMII2.RGMII_RXD0
RGMII2_RXD1: R290.2 ; port RGMII2.RGMII_RXD1
RGMII2_RXD2: R287.2 ; port RGMII2.RGMII_RXD2
RGMII2_RXD3: R283.2 ; port RGMII2.RGMII_RXD3
RGMII2_TX_CLK: IC26.76(P6_INCLK) ; port RGMII2.RGMII_TX_CLK
RGMII2_TX_CTL: IC26.77(P6_INDV) ; port RGMII2.RGMII_TX_CTL
RGMII2_TXD0: IC26.78(P6_IND0) ; port RGMII2.RGMII_TXD0
RGMII2_TXD1: IC26.79(P6_IND1) ; port RGMII2.RGMII_TXD1
RGMII2_TXD2: IC26.80(P6_IND2) ; port RGMII2.RGMII_TXD2
RGMII2_TXD3: IC26.81(P6_IND3) ; port RGMII2.RGMII_TXD3
RX0_N: C405.1 C1007.1 ; port PORT0.Rx0_N
RX0_P: C404.1 C1005.1 ; port PORT0.Rx0_P
RX0_SoC_N: C1007.2 ; port PORT0_SoC.Rx0_N
RX0_SoC_P: C1005.2 ; port PORT0_SoC.Rx0_P
RX1_N: C409.1 ; port PORT1.Rx1_N
RX1_P: C408.1 ; port PORT1.Rx1_P
SCL_ETH_SWITCH: IC26.98(EE_CLK/C0_LED/FLOW) IC28.6(SCL) LD3.2(A) R277.2 R278.1 W1.2
SDA_ETH_SWITCH: IC26.97(EE_DOUT/C1_LED/P4_LED0) IC28.5(SDA) LD4.2(A) R291.2 W1.3
TX0_N: C407.1 C1029.1 ; port PORT0.Tx0_N
TX0_P: C406.1 C1028.1 ; port PORT0.Tx0_P
TX0_SoC_N: C1029.2 ; port PORT0_SoC.Tx0_N
TX0_SoC_P: C1028.2 ; port PORT0_SoC.Tx0_P
TX1_N: C411.1 ; port PORT1.Tx1_N
TX1_P: C410.1 ; port PORT1.Tx1_P
VDD_CORE: C426.2 C427.2 C428.2 C429.2 IC26.38(VDD_CORE) IC26.62(VOUT11_SEN) IC26.63(VOUT11) IC26.65(VDD_CORE) IC26.96(VDD_CORE)
NetC414_2: C414.2 IC26.34(XTAL_IN) Q2.3(X)
NetC415_2: C415.2 IC26.35(XTAL_OUT) Q2.1(X)
NetC425_1: C425.1 IC26.64(CBOT)
NetC425_2: C425.2 IC26.59(CTOP)
NetIC26_28: IC26.28(RSET) R258.2
NetIC26_37: IC26.37(P5_OUTD3/P5_VDDOS1) R246.1 R247.1
NetIC26_39: IC26.39(P5_OUTD2/P5_MODE2) R248.1 R249.1
NetIC26_41: IC26.41(P5_OUTD1/P5_MODE1) R250.1 R251.1
NetIC26_42: IC26.42(P5_OUTD0/P5_MODE0) R252.1 R253.1
NetIC26_43: IC26.43(P5_OUTEN/P5_VDDOS0) R243.1 R244.1 R1001.1
NetIC26_44: IC26.44(P5_OUTCLK/GPIO0) R245.1
NetIC26_45: IC26.45(P5_INCLK/GPIO1) R235.1
NetIC26_46: IC26.46(P5_INDV/GPIO2) R240.1
NetIC26_48: IC26.48(P5_IND0) R239.1
NetIC26_49: IC26.49(P5_IND1) R238.1
NetIC26_50: IC26.50(P5_IND2/GPIO5) R237.1
NetIC26_51: IC26.51(P5_IND3/GPIO6) R236.1
NetIC26_52: IC26.52(P5_COL/MDIO_PHY/GPIO7) R242.1
NetIC26_53: IC26.53(P5_CRS/MDC_PHY/GPIO8) R241.1 R1001.2
NetIC26_66: IC26.66(TEST) R293.2
NetIC26_67: IC26.67(GPIO4/P1_SMODE) R265.1
NetIC26_68: IC26.68(GPIO3/P0_SMODE) R269.1
NetIC26_69: IC26.69(P6_OUTD3/P6_VDDOS1) R282.1 R283.1
NetIC26_70: IC26.70(P6_OUTD2/P6_MODE2) R286.1 R287.1
NetIC26_71: IC26.71(P6_OUTD1/P6_MODE1) R289.1 R290.1
NetIC26_72: IC26.72(P6_OUTD0/P6_MODE0) R294.1 R295.1
NetIC26_73: IC26.73(P6_OUTEN/P6_VDDOS0) R260.1 R261.1
NetIC26_75: IC26.75(P6_OUTCLK) R262.1
NetIC26_83: IC26.83(P6_OUTD7/P2_OUTD3/ADDR4n) R271.1 R272.1
NetIC26_84: IC26.84(P6_OUTD6/P2_OUTD2/ADDR3n) R273.1 R274.1
NetIC26_85: IC26.85(P6_OUTD5/P2_OUTD1/ADDR2n) R275.1 R276.1
NetIC26_86: IC26.86(P6_OUTD4/P2_OUTD0/ADDR1n) R279.1 R280.1
NetIC26_87: IC26.87(P2_OUTEN/EEE_WP) R263.1 R264.1
NetIC26_88: IC26.88(P6_GTXCLK/P2_OUTCLK/ADDR0n) R259.1 R1000.1
NetIC26_100: IC26.100(R2_LED/P3_LED0/NO_CPU) R266.2 R267.1 R284.2 R292.2
NetIC26_101: IC26.101(R1_LED/P1_LED0/LED_SEL1) R268.2
NetIC26_102: IC26.102(R0_LED/P0_LED0/LED_SEL0) R270.2
NetIC47_6: IC47.6(OE) R254.1
NetLD3_1: LD3.1(C) R284.1
NetLD4_1: LD4.1(C) R292.1

Not connected (* = marked no-connect by the designer): IC26 17(P4_MDIP0) 18(P4_MDIN0) 20(P4_MDIP1) 21(P4_MDIN1) 23(P4_MDIP2) 24(P4_MDIN2) 25(P4_MDIP3) 26(P4_MDIN3) 29(NC)* 30(NC)* 31(NC)* 32(SE_SCLK)*; J7 14 15 16

### Layout directives
net class MII: MII1_COL, MII1_CRS, MII1_INT, MII1_MDC, MII1_MDIO, MII1_MODE, MII1_RX_CLK, MII1_RX_DV, MII1_RX_ER, MII1_RXD0, MII1_RXD1, MII1_RXD2, MII1_RXD3, MII1_TX_CLK, MII1_TX_EN, MII1_TXD0, MII1_TXD1, MII1_TXD2, MII1_TXD3, PHY_RESETn
net class PHY_ETH: MII1_COL, MII1_CRS, MII1_INT, MII1_MDC, MII1_MDIO, MII1_MODE, MII1_RX_CLK, MII1_RX_DV, MII1_RX_ER, MII1_RXD0, MII1_RXD1, MII1_RXD2, MII1_RXD3, MII1_TX_CLK, MII1_TX_EN, MII1_TXD0, MII1_TXD1, MII1_TXD2, MII1_TXD3, PHY_RESETn, RGMII1_RX_CLK, RGMII1_RX_CTL, RGMII1_RXD0, RGMII1_RXD1, RGMII1_RXD2, RGMII1_RXD3, RGMII1_TX_CLK, RGMII1_TX_CTL, RGMII1_TXD0, RGMII1_TXD1, RGMII1_TXD2, RGMII1_TXD3, RGMII2_MDC, RGMII2_MDIO, RGMII2_RX_CLK, RGMII2_RX_CTL, RGMII2_RXD0, RGMII2_RXD1, RGMII2_RXD2, RGMII2_RXD3, RGMII2_TX_CLK, RGMII2_TX_CTL, RGMII2_TXD0, RGMII2_TXD1, RGMII2_TXD2, RGMII2_TXD3
net class RGMII1: RGMII1_RX_CLK, RGMII1_RX_CTL, RGMII1_RXD0, RGMII1_RXD1, RGMII1_RXD2, RGMII1_RXD3, RGMII1_TX_CLK, RGMII1_TX_CTL, RGMII1_TXD0, RGMII1_TXD1, RGMII1_TXD2, RGMII1_TXD3
net class RGMII2: RGMII2_MDC, RGMII2_MDIO, RGMII2_RX_CLK, RGMII2_RX_CTL, RGMII2_RXD0, RGMII2_RXD1, RGMII2_RXD2, RGMII2_RXD3, RGMII2_TX_CLK, RGMII2_TX_CTL, RGMII2_TXD0, RGMII2_TXD1, RGMII2_TXD2, RGMII2_TXD3
net class PORT0: P0_RX_N, P0_RX_P, P0_TX_N, P0_TX_P, RX0_N, RX0_P, RX0_SoC_N, RX0_SoC_P, TX0_N, TX0_P, TX0_SoC_N, TX0_SoC_P
differential pair: P0_RX_N, P0_RX_P, P0_TX_N, P0_TX_P, P1_RX_N, P1_RX_P, P1_TX_N, P1_TX_P, P3_MDI0_N, P3_MDI0_P, P3_MDI1_N, P3_MDI1_P, P3_MDI2_N, P3_MDI2_P, P3_MDI3_N, P3_MDI3_P, RX0_SoC_N, RX0_SoC_P, TX0_SoC_N, TX0_SoC_P
net class GTY; net class GT: P0_RX_N, P0_RX_P, P0_TX_N, P0_TX_P, P1_RX_N, P1_RX_P, P1_TX_N, P1_TX_P, RX0_N, RX0_P, RX0_SoC_N, RX0_SoC_P, RX1_N, RX1_P, TX0_N, TX0_P, TX0_SoC_N, TX0_SoC_P, TX1_N, TX1_P
net class PORT1: P1_RX_N, P1_RX_P, P1_TX_N, P1_TX_P
net class PWR: P3V3_SW, P3V3AVDD, VDD_CORE

### Notes on the sheet
- CHANGE MII MODE
- P5_VDDOS[1:0] = 10 -> 3.3V operation
- (near R254) P5_MODE[2:0] = 0x1 => MII PHY  mode
- (near IC47) 1V8
- (near IC47) 3V3
- (near Q2) LED_SEL[1:0] = 0x0 -> PORT0, PORT1, link, act speed R2
- ADDR[4:0] = 1F -> single chip addressing mode
- NO_CPU=1 -> config via pullups
- FLOW=1 -> enable flow control
- VDDOS[1:0] = 00 -> 1.8V operation for PORT6
- P6_MODE[2..0] = 0x7 -> RGMII mode
- Px_MODE = 1-> 1000BASE-X or SGMII mode
- (near W1) Switch EEPROM programmer
- Project/Equipment
- Document
- Designer
- Drawn by
- Check.by
- Copyright WUT ISE 2021
  This documentation describes Open Hardware and is licensed under CERN OHL v.1.1. You may redistribute and modify this documentaction under the terms of the CERN OHL v1.1.
  (http://ohwr.org/CERNOHL). This documentation is dristributed WITHOUT ANY EXPRESS OR IMPLIED WARRANTY, INCLUDING OF MERCHANTABLITY, SATISFACTORY QUALITY AND FITNESS FOR A PARTICULAR PURPOSE. Please see the CERN OHL v.1.1 for applicable conditions
- File
- Last Mod.
- Print Date
- Sheet
- Size
- A3
- of
- Rev
- Contact:
- (in symbol R0201_100R_1%_0.05W_200PPM) 1%
- (in symbol R0402_4K7_1%_0.0625W_100PPM) 1%
- (in symbol R0402_22R_1%_0.0625W_100PPM) 1%
- (in symbol R0603_4K99_1%_0.063W_50PPM) 1%
- (in symbol TXS0102DCUR) VCCA; VCCB

### Library data of the parts
C404-C413 C416-C424 C426-C435 C437-C444 C1005 C1007 C1028 C1029 = CC0201_100NF_6.3V_10%_X5R: Non-polarised capacitor; Manufacturer: GENERIC; Part Description: SMD Multilayer Chip Ceramic Capacitor; Manufacturer1 Part Number: 02016D104KAT2A; Tolerance: ±10%; Voltage: 6.3V; TC: X5R; Manufacturer Part Number: CC0201_100NF_6.3V_10%_X5R; Part Number: CC0201_100NF_6.3V_10%_X5R; Value: 100nF; Component Kind: Standard; Component Type: Standard; Pin Count: 2; Status: Not Recommended; Case: 0201; Mounted: Yes; Socket: No; SMD: Yes; Sense: No; Manufacturer1 Example: AVX; Manufacturer1 ComponentHeight: 0.33mm; HelpURL: \\cern.ch\dfs\Applications\Altium\Datasheets\CC0201_X5R_AVX.pdf; Author: CERN DEM JLC; CreateDate: 03/12/2007; LatestRevisionDate: 03/12/2007
C414 C415 = CC0402_15PF_50V_5%_C0G: Non-polarised capacitor; Manufacturer: GENERIC; Part Description: SMD Multilayer Chip Ceramic Capacitor; Manufacturer1 Part Number: C0402C150J5GACTU; Tolerance: ±5%; Voltage: 50V; TC: C0G/NP0; Manufacturer Part Number: CC0402_15PF_50V_5%_C0G; Part Number: CC0402_15PF_50V_5%_C0G; Value: 15pF; Component Kind: Standard; Component Type: Standard; Pin Count: 2; Status: Preferred; Case: 0402; Mounted: Yes; Socket: No; SMD: Yes; Sense: No; Manufacturer1 Example: KEMET; Manufacturer1 ComponentHeight: 0.55mm; HelpURL: \\cern.ch\dfs\Applications\Altium\Datasheets\CC0805_C0G_KEMET_(Commercial Grade).pdf; Author: CERN DEM JLC; CreateDate: 03.12.2007; LatestRevisionDate: 22.04.2015
C425 = CC0402_68NF_16V_10%_X7R: Non-polarised capacitor; Manufacturer: GENERIC; Part Description: SMD Multilayer Chip Ceramic Capacitor; Manufacturer1 Part Number: 223878715647; Tolerance: ±10%; Voltage: 16V; TC: X7R; Manufacturer Part Number: CC0402_68NF_16V_10%_X7R; Part Number: CC0402_68NF_16V_10%_X7R; Value: 68nF; Component Kind: Standard; Component Type: Standard; Pin Count: 2; Status: Not Recommended; Case: 0402; Mounted: Yes; Socket: No; SMD: Yes; Sense: No; Manufacturer1 Example: PHYCOMP; Manufacturer1 ComponentHeight: 0.55mm; HelpURL: \\cern.ch\dfs\Applications\Altium\Datasheets\CC0402_X7R_PHYCOMP.pdf; Author: CERN DEM JLC; CreateDate: 03.12.2007; LatestRevisionDate: 03.12.2007
C436 = CC0603_10uF_6.3V_20%_X5R: Non-polarised capacitor; Manufacturer: GENERIC; Part Description: SMD Multilayer Chip Ceramic Capacitor; Manufacturer1 Part Number: C0603C106M9PAC; Tolerance: ±20%; Voltage: 6.3V; TC: X5R; Manufacturer Part Number: CC0603_10uF_6.3V_20%_X5R; Part Number: CC0603_10UF_6.3V_20%_X5R; Value: 10uF; Component Kind: Standard; Component Type: Standard; Pin Count: 2; Status: Preferred; Case: 0603; Mounted: Yes; Socket: No; SMD: Yes; Sense: No; Manufacturer1 Example: KEMET; Manufacturer1 ComponentHeight: 0.95mm; HelpURL: \\cern.ch\dfs\Applications\Altium\Datasheets\CC0603_X5R_KEMET.pdf; Author: CERN DEM JLC; CreateDate: 03.12.2007; LatestRevisionDate: 03.12.2007
IC26 = 88E6321-A0-NAZ2I000: 7 Port Gigabit AVB Switch With 2 PHYs And Energy Efficient Ethernet (EEE); Manufacturer: MARVELL; PressFit: No; Bonding: No; Manufacturer Part Number: 88E6321-A0-NAZ2I000; PackageDescription: QFN, 0.40mm pitch, square; 27 pin X 27 pin, 12.00mm X 12.00mm, IPC Medium Density; Part Description: 7 Port Gigabit AVB Switch With 2 PHYs And Energy Efficient Ethernet (EEE); Part Number: 88E6321-A0-NAZ2I000; Component Kind: Standard; Component Type: Standard; Device: 88E6321-A0-NAZ2I000; Status: Not Recommended; Pin Count: 109; Case: QFN108; Mounted: Yes; Socket: No; SMD: Yes; Sense: No; ComponentHeight: 0.9mm; HelpURL: \\cern.ch\dfs\Applications\Altium\Datasheets\88E6321-A0-NAZ2I000.pdf; Author: CERN DEM MR; CreateDate: 23/05/2016; LatestRevisionDate: 30/03/2017
IC28 = 24LC024H-I/SN: 2K I2C Serial EEPROM With Half-Array Write Protect; Manufacturer: MICROCHIP TECHNOLOGY; Part Description: 2.5V-5.5V, 2K (256 x 8-bit) I2C Serial EEPROM With Half-Array Write Protect; PressFit: No; Bonding: No; Manufacturer Part Number: 24LC024H-I/SN; PackageDescription: SOIC 8, Pitch 1.27mm - Body 4x5mm, IPC Medium Density; Part Number: 24LC024H-I/SN; Component Kind: Standard; Component Type: Standard; Device: 24LC024H-I/SN; Pin Count: 8; Case: SOIC8; Mounted: Yes; Socket: No; SMD: Yes; Sense: No; ComponentHeight: 1.75mm; HelpURL: \\cern.ch\dfs\Applications\Altium\Datasheets\24LC024H-I-SN.pdf; Author: CERN DEM JLC; CreateDate: 24.01.2011; LatestRevisionDate: 24.01.2011
IC47 = TXS0102DCUR: 2-Bit Bidirectionnal Voltage-Level Translator for Open-Drain And Push-Pull Applications; Manufacturer: TEXAS INSTRUMENTS; PressFit: No; Bonding: No; Manufacturer Part Number: TXS0102DCUR; PackageDescription: SOP, 0.50mm Pitch; 8 pin, 2.30mm W X 2.00mm L X 0.90mm H body, PC Medium Density; Part Description: 2-Bit Bidirectionnal Voltage-Level Translator for Open-Drain And Push-Pull Applications; Part Number: TXS0102DCUR; Component Kind: Standard; Component Type: Standard; Device: TXS0102DCUR; Pin Count: 8; Case: TSSOP8; Mounted: Yes; Socket: No; SMD: Yes; Sense: No; ComponentHeight: 0.9mm; Author: CERN DEM JLC; HelpURL: \\cern.ch\dfs\Applications\Altium\Datasheets\TXS0102DCUR.pdf; CreateDate: 08/07/2014; LatestRevisionDate: 08/07/2014
J7 = MOLEX_87759-1650: Connector 16 Male; Part Description: 2.00mm (.079") Pitch Milli-Grid™ Header, Vertical with Press-fit Plastic Pegs, 16 Circuits; Manufacturer: MOLEX; PressFit: No; Part Number: MOLEX_87759-1650; Component Kind: Standard; Component Type: Standard; Pin Count: 16; Family: Milli-Grid™; Mounted: Yes; Socket: No; SMD: Yes; Sense: No; Status: None; Manufacturer Part Number: 87759-1650; ComponentHeight: 5.3mm; HelpURL: \\cern.ch\dfs\Applications\Altium\Datasheets\MOLEX_87759-1650.pdf; Author: CERN DEM MR; CreateDate: 31.05.2016; LatestRevisionDate: 31.05.2016
L34 L35 = IND0603_MURATA_BLM18SG121TN1D: Inductor; Manufacturer: MURATA; Part Description: SMD EMIFIL Suppression Chip Ferrite Bead; Tolerance: ±25%; Power: 3A; Resistance: 0.025R; Manufacturer Part Number: BLM18SG121TN1D; Part Number: IND0603_MURATA_BLM18SG121TN1D; Value: 120R@100MHz; Component Kind: Standard; Component Type: Standard; Pin Count: 2; Status: None; Case: 0603; Mounted: Yes; Socket: No; SMD: Yes; Sense: No; ComponentHeight: 0.65mm; HelpURL: \\cern.ch\dfs\Applications\Altium\Datasheets\IND0603_MURATA_BLM18S.pdf; Author: CERN DEM JLC; CreateDate: 23/07/2014; LatestRevisionDate: 23/07/2014
LD3 LD4 = LED_KINGBRIGHT_KPH-1608CGCK: LED Green 1C 2A; Part Description: SMD Green LED, Case 1.6mmX0.8mm(0603), 0.65mm Thickness; Bonding: No; PressFit: No; Author: CERN DEM JLC; Color: Green; Component Kind: Standard; Component Type: Standard; ComponentHeight: 0.65mm; CreateDate: 03.07.2017; HelpURL: \\cern.ch\dfs\Applications\Altium\Datasheets\LED_KINGBRIGHT_KPH-1608CGCK.pdf; LatestRevisionDate: 03.07.2017; Manufacturer Part Number: KPH-1608CGCK; Manufacturer: KINGBRIGHT; Mounted: Yes; PackageDescription: SMT Green LED, Case 0603, Body L 1.6 x W 0.8mm H 0.65mm; Part Number: LED_KINGBRIGHT_KPH-1608CGCK; Pin Count: 2; Sense: No; SMD: Yes; Socket: No
Q2 = XTAL_25MHZ_TXC_8Y-25.000MAAJ-T: Crystal 4 pins 1=XTAL Control 2=GND3=XTAL 4=GND; Manufacturer: TXC CORPORATION; Part Description: ±30ppm 18pF -20°C to +70°C  4 Pins, 2x1.6X0.5mm, SMD Seam Sealing Crystal, 8Y Serie; PressFit: No; Bonding: No; Manufacturer Part Number: 8Y-25.000MAAJ-T; PackageDescription: 4 Pins, 2x1.6X0.5mm, SMD Seam Sealing Crystal, 8Y Serie; Part Number: XTAL_25MHZ_TXC_8Y-25.000MAAJ-T; Value: 25MHz; Component Kind: Standard; Component Type: Standard; Pin Count: 4; Mounted: Yes; Socket: No; SMD: Yes; Sense: No; ComponentHeight: 13.6mm; HelpURL: \\cern.ch\dfs\Applications\Altium\Datasheets\XTAL_TXC_8Y.pdf; Author: CERN DEM JLC; CreateDate: 08.03.2012; LatestRevisionDate: 08.03.2012
R234-R242 R244 R245 R247 R249 R251 R253 = R0201_100R_1%_0.05W_200PPM: Resistor - 1%; Manufacturer: GENERIC; Part Description: Thick Film Chip Resistor; Manufacturer1 Part Number: CRCW0201100RFNED; Power: 0.05W; TC: ±200ppm/°C; PressFit: No; Manufacturer Part Number: R0201_100R_1%_0.05W_200PPM; Part Number: R0201_100R_1%_0.05W_200PPM; Tolerance: ±1%; Value: 100; Component Kind: Standard; Component Type: Standard; Pin Count: 2; Status: Not Recommended; Case: 0201; Mounted: Yes; Sense: No; Socket: No; SMD: Yes; Manufacturer1 Example: VISHAY; Manufacturer1 ComponentHeight: 0.27mm; HelpURL: \\cern.ch\dfs\Applications\Altium\Datasheets\R0201_VISHAY_CRCW0201 e3.pdf; Author: CERN DEM JLC; CreateDate: 13.11.2014; LatestRevisionDate: 13.11.2014
R243 R246 R248 R250 R252 R254-R256 R260 R263 R265 R266 R268-R271 R273 R275 R277 R279 R281 R282 R284-R286 R288 R289 R291-R294 R1000 = R0402_4K7_1%_0.0625W_100PPM: Resistor - 1%; Manufacturer: GENERIC; Part Description: General Purpose Thick Film Chip Resistor; Manufacturer1 Part Number: 232270674702L; TC: ±100ppm/°C; PressFit: No; Manufacturer Part Number: R0402_4K7_1%_0.0625W_100PPM; Part Number: R0402_4K7_1%_0.0625W_100PPM; Tolerance: ±1%; Value: 4k7; Component Kind: Standard; Component Type: Standard; Pin Count: 2; Status: Not Recommended; Power: 0.0625W; Case: 0402; Mounted: Yes; Sense: No; Socket: No; SMD: Yes; Manufacturer1 Example: YAGEO PHYCOMP; Manufacturer1 ComponentHeight: 0.4mm; HelpURL: \\cern.ch\dfs\Applications\Altium\Datasheets\R0402_Phycomp_RC0402.pdf; Author: CERN DEM JLC; CreateDate: 03/12/2007; LatestRevisionDate: 17/10/2012
R258 = R0603_4K99_1%_0.063W_50PPM: Resistor - 1%; Manufacturer: GENERIC; Part Description: General Purpose Thick Film Chip Resistor; Manufacturer1 Part Number: CPF0603F4K99C1; Power: 0.1W; TC: ±50ppm/°C; PressFit: No; Manufacturer Part Number: R0603_4K99_1%_0.063W_50PPM; Part Number: R0603_4K99_1%_0.063W_50PPM; Tolerance: ±1%; Value: 4k99; Component Kind: Standard; Component Type: Standard; Pin Count: 2; Status: None; Case: 0603; Mounted: Yes; Sense: No; Socket: No; SMD: Yes; Manufacturer1 Example: TYCO NEOHM; Manufacturer1 ComponentHeight: 0.55mm; HelpURL: \\cern.ch\dfs\Applications\Altium\Datasheets\R0603_TYCO_CPF.pdf; Author: CERN DEM JLC; CreateDate: 20.05.2010; LatestRevisionDate: 20.05.2010
R259 R261 R262 R264 R272 R274 R276 R280 R283 R287 R290 R295 = R0402_22R_1%_0.0625W_100PPM: Resistor - 1%; Manufacturer: GENERIC; Part Description: General Purpose Thick Film Chip Resistor; Manufacturer1 Part Number: 232270672209L; TC: ±100ppm/°C; PressFit: No; Manufacturer Part Number: R0402_22R_1%_0.0625W_100PPM; Part Number: R0402_22R_1%_0.0625W_100PPM; Tolerance: ±1%; Value: 22; Component Kind: Standard; Component Type: Standard; Pin Count: 2; Status: Not Recommended; Power: 0.0625W; Case: 0402; Mounted: Yes; Sense: No; Socket: No; SMD: Yes; Manufacturer1 Example: YAGEO PHYCOMP; Manufacturer1 ComponentHeight: 0.4mm; HelpURL: \\cern.ch\dfs\Applications\Altium\Datasheets\R0402_Phycomp_RC0402.pdf; Author: CERN DEM JLC; CreateDate: 03/12/2007; LatestRevisionDate: 17/10/2012
R267 R278 R1001 = R0402_0R_JUMPER: Resistor; Part Description: 1A (0.05R Max DC Resistance) Zero Ohm Jumper; Manufacturer: GENERIC; Manufacturer1 Part Number: 232270591001L; PressFit: No; Part Number: R0402_0R_JUMPER; Component Kind: Standard; Component Type: Standard; Pin Count: 2; Value: 0; Status: Not Recommended; Manufacturer Part Number: R0402_0R_JUMPER; Case: 0402; Mounted: Yes; Sense: No; Socket: No; SMD: Yes; Manufacturer1 Example: YAGEO PHYCOMP; Manufacturer1 ComponentHeight: 0.4mm; HelpURL: \\cern.ch\dfs\Applications\Altium\Datasheets\R0402_Phycomp_RC0402.pdf; Author: CERN DEM JLC; CreateDate: 03.12.2007; LatestRevisionDate: 17.10.2012
W1 = SAMTEC_MTLW-104-07-L-S-250: 4 Mini Wire-Wrap Contact Strip Header; Manufacturer: SAMTEC; Part Description: 4 Contacts, Pitch 2.54mm, Single Row Through Mount Straight Header (Post Lead = 6.35mm, Tail Lead 3.05mm, Insulator 1.52mm); PressFit: No; Manufacturer Part Number: MTLW-104-07-L-S-250; Part Number: SAMTEC_MTLW-104-07-L-S-250; Component Kind: Standard; Component Type: Standard; Pin Count: 4; Family: Header 4; Mounted: Yes; Socket: No; Sense: No; SMD: No; Status: None; ComponentHeight: 7.87mm; HelpURL: \\cern.ch\dfs\Applications\Altium\Datasheets\SAMTEC_MTLW-104-07-L-S-250.pdf; Author: CERN DEM JLC; CreateDate: 13.12.2012; LatestRevisionDate: 13.12.2012

## Sheet AMC_Connector.SchDoc: RFSoC AMC
size 420 x 297 mm; CmpIndex: 8; CompanyName: WUT; DrawnBy: T. Przywozki; Organization: WUT ISE; Address1: Warsaw University of Technology; Address2: Nowowiejska 15/19 00-665 Warsaw; Address3: Tomasz.Przywozki@pw.edu.pl; DocumentNumber: 27; Revision: 1; SheetNumber: 27; SheetTotal: 45; Project: RFSoC AMC; ModifiedBy: T. Przywozki; CreateDate: -; CheckedDate: -; DivGrp: ISE; Designer: T. Przywozki; ModifiedDate: -; ProjectName: ADC/DAC MEZZANINE
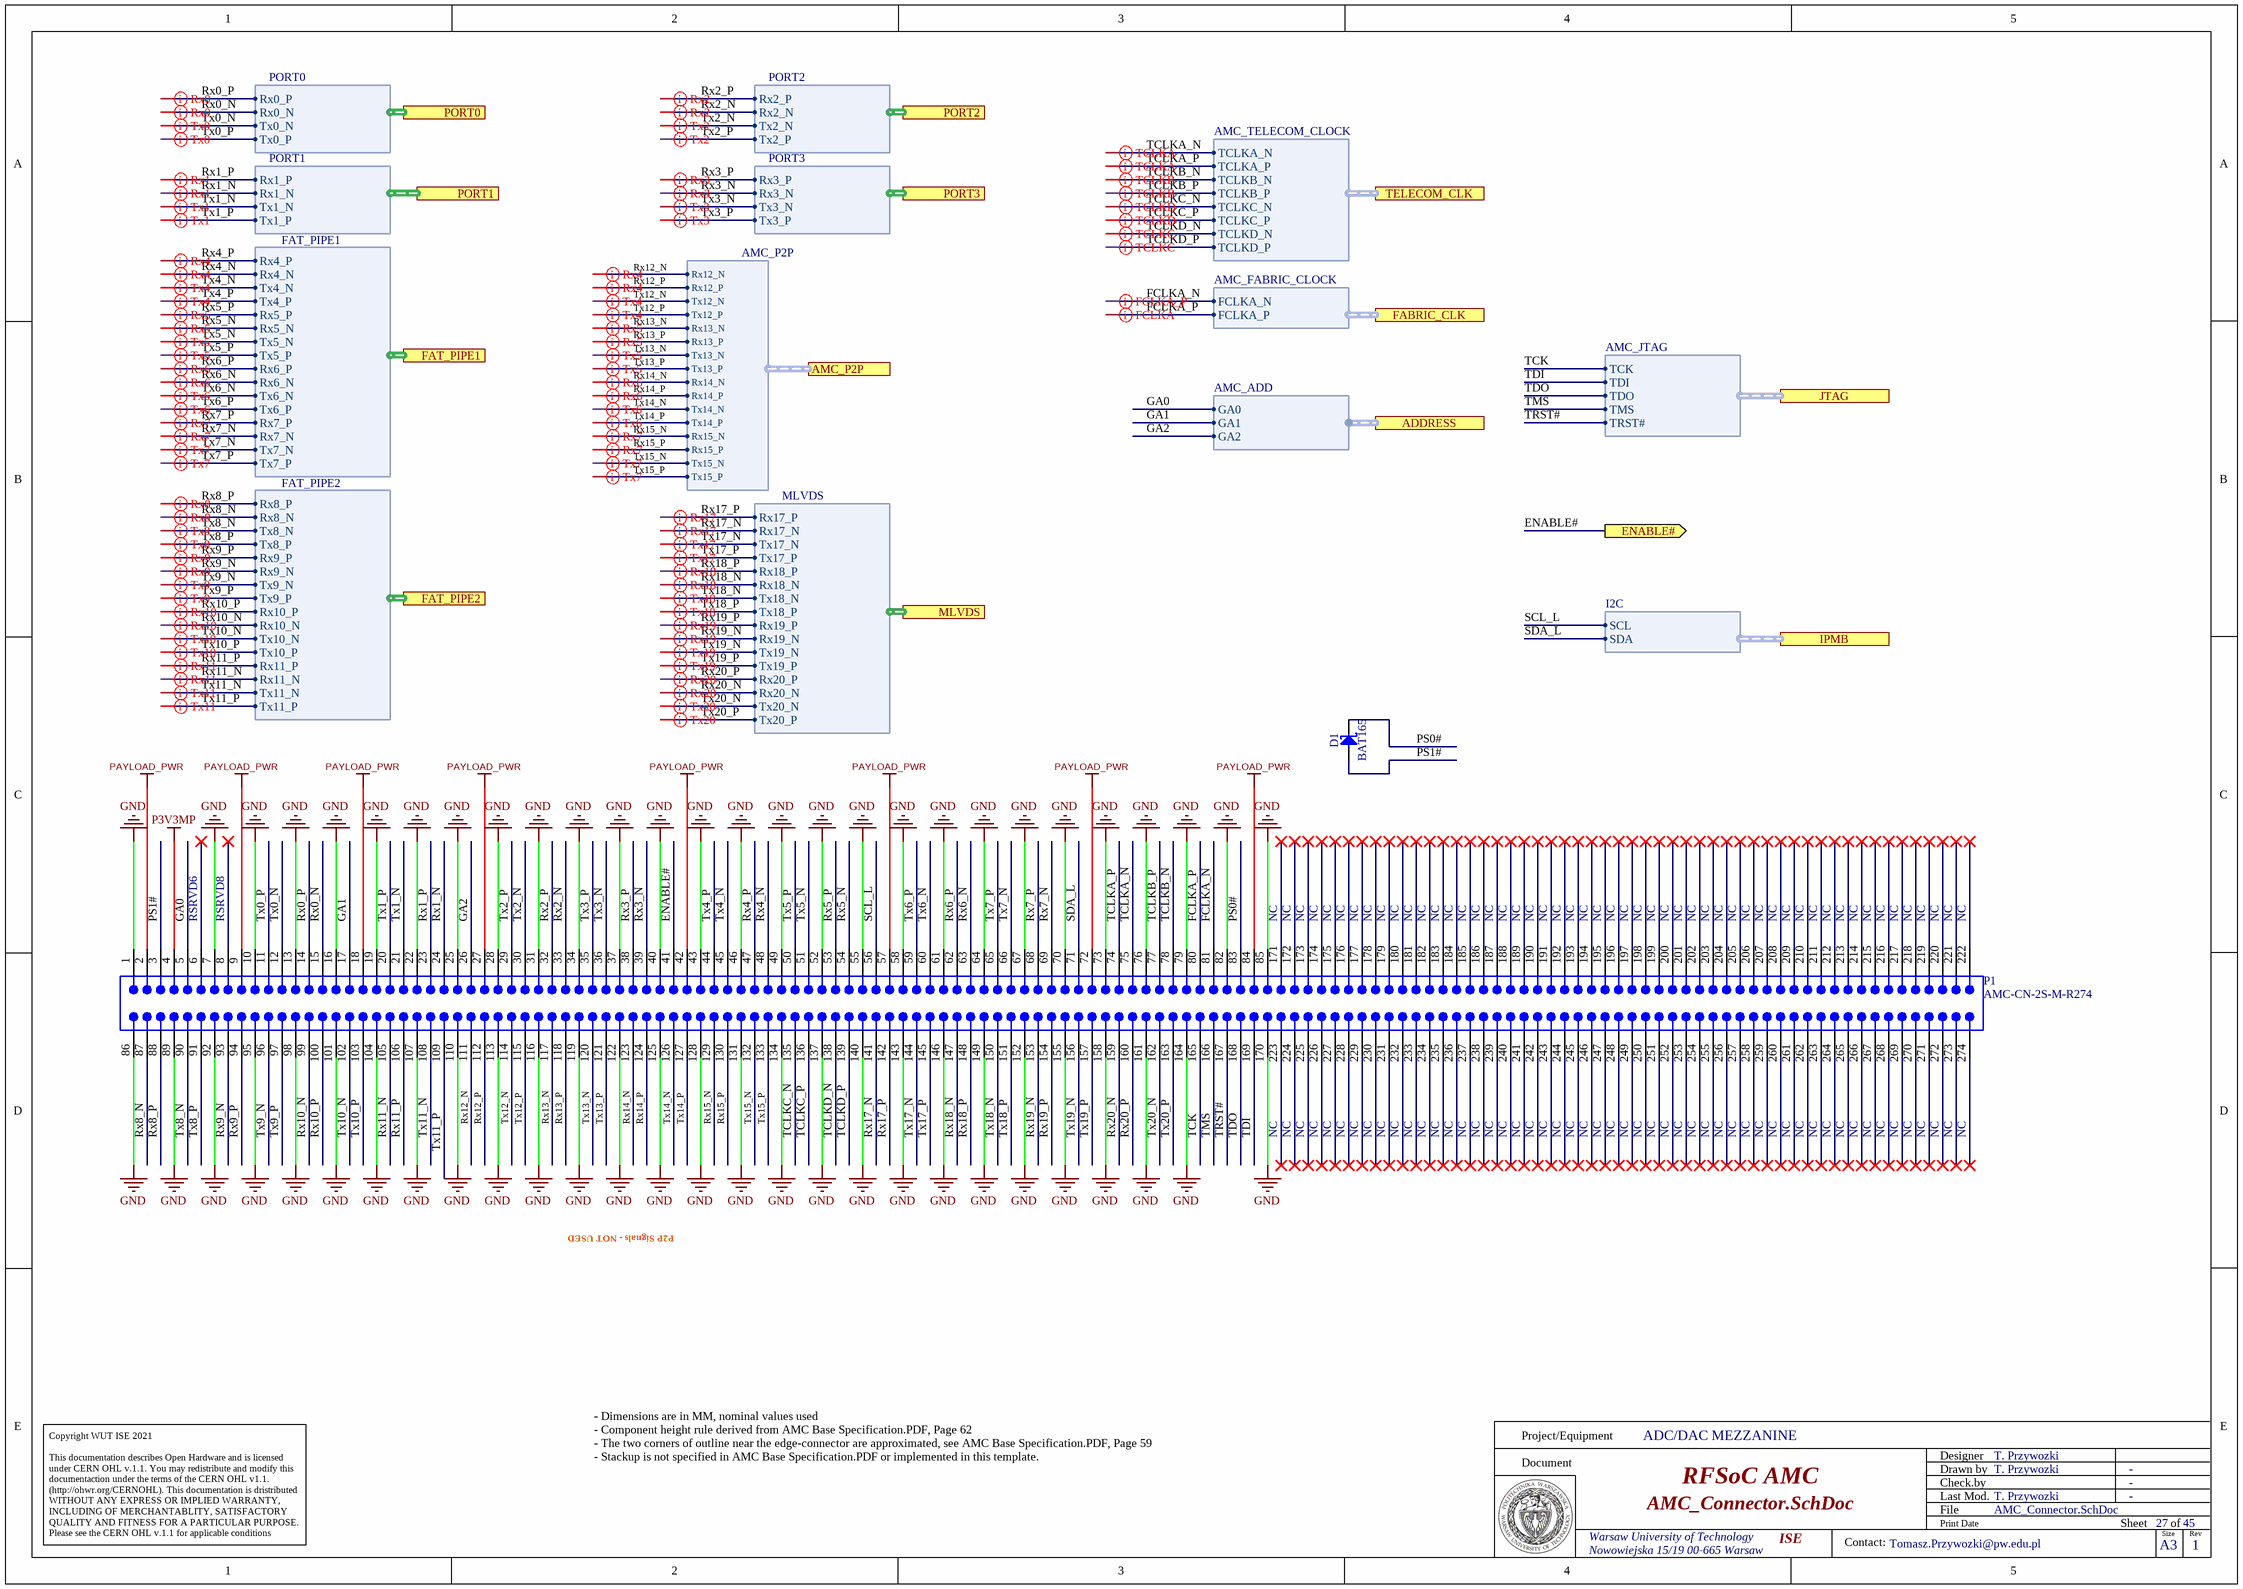
[diagram p11: AMC_Connector.SchDoc]

### Parts
D1  BAT165  [SOD2512X110N]
P1  AMC-CN-2S-M-R274  [AMC-GF-2D-750-O274]  (no BOM)

### Ports
ADDRESS (harness AMC_ADD), AMC_P2P (harness AMC_P2P), ENABLE# (out), FABRIC_CLK (harness AMC_FABRIC_CLOCK), FAT_PIPE1 (harness FAT_PIPE1), FAT_PIPE2 (harness FAT_PIPE2), IPMB (harness I2C), JTAG (harness AMC_JTAG), MLVDS (harness MLVDS), PORT0 (harness PORT0), PORT1 (harness PORT1), PORT2 (harness PORT2), PORT3 (harness PORT3), TELECOM_CLK (harness AMC_TELECOM_CLOCK)

### Harnesses
AMC_JTAG: TCK, TDI, TDO, TMS, TRST#
AMC_TELECOM_CLOCK: TCLKA_N, TCLKA_P, TCLKB_N, TCLKB_P, TCLKC_N, TCLKC_P, TCLKD_N, TCLKD_P
AMC_FABRIC_CLOCK: FCLKA_N, FCLKA_P
I2C: SCL, SDA
PORT0: Rx0_P, Rx0_N, Tx0_N, Tx0_P
PORT1: Rx1_P, Rx1_N, Tx1_N, Tx1_P
FAT_PIPE1: Rx4_P, Rx4_N, Tx4_N, Tx4_P, Rx5_P, Rx5_N, Tx5_N, Tx5_P, Rx6_P, Rx6_N, Tx6_N, Tx6_P, Rx7_P, Rx7_N, Tx7_N, Tx7_P
FAT_PIPE2: Rx8_P, Rx8_N, Tx8_N, Tx8_P, Rx9_P, Rx9_N, Tx9_N, Tx9_P, Rx10_P, Rx10_N, Tx10_N, Tx10_P, Rx11_P, Rx11_N, Tx11_N, Tx11_P
MLVDS: Rx17_P, Rx17_N, Tx17_N, Tx17_P, Rx18_P, Rx18_N, Tx18_N, Tx18_P, Rx19_P, Rx19_N, Tx19_N, Tx19_P, Rx20_P, Rx20_N, Tx20_N, Tx20_P
PORT2: Rx2_P, Rx2_N, Tx2_N, Tx2_P
PORT3: Rx3_P, Rx3_N, Tx3_N, Tx3_P
AMC_ADD: GA0, GA1, GA2
AMC_P2P: Rx12_N, Rx12_P, Tx12_N, Tx12_P, Rx13_N, Rx13_P, Tx13_N, Tx13_P, Rx14_N, Rx14_P, Tx14_N, Tx14_P, Rx15_N, Rx15_P, Tx15_N, Tx15_P

### Nets
GND: P1.1 P1.7 P1.10 P1.13 P1.16 P1.19 P1.22 P1.25 P1.28 P1.31 P1.34 P1.37 P1.40 P1.43 P1.46 P1.49 P1.52 P1.55 P1.58 P1.61 P1.64 P1.67 P1.70 P1.73 P1.76 P1.79 P1.82 P1.85 P1.86 P1.89 P1.92 P1.95 P1.98 P1.101 P1.104 P1.107 P1.110 P1.113 P1.116 P1.119 P1.122 P1.125 P1.128 P1.131 P1.134 P1.137 P1.140 P1.143 P1.146 P1.149 P1.152 P1.155 P1.158 P1.161 P1.164 P1.170
P3V3MP: P1.4
PAYLOAD_PWR: P1.2 P1.9 P1.18 P1.27 P1.42 P1.57 P1.72 P1.84
ENABLE#: P1.41 ; port ENABLE#  [project net AMC_En]
FCLKA_N: P1.81 ; port FABRIC_CLK.FCLKA_N
FCLKA_P: P1.80 ; port FABRIC_CLK.FCLKA_P
GA0: P1.5 ; port ADDRESS.GA0
GA1: P1.17 ; port ADDRESS.GA1
GA2: P1.26 ; port ADDRESS.GA2
PS0#: D1.1(C) P1.83
PS1#: D1.2(A) P1.3
RX0_N: P1.15 ; port PORT0.Rx0_N
RX0_P: P1.14 ; port PORT0.Rx0_P
RX1_N: P1.24 ; port PORT1.Rx1_N
RX1_P: P1.23 ; port PORT1.Rx1_P
Rx2_N: P1.33 ; port PORT2.Rx2_N
Rx2_P: P1.32 ; port PORT2.Rx2_P
Rx3_N: P1.39 ; port PORT3.Rx3_N
Rx3_P: P1.38 ; port PORT3.Rx3_P
Rx4_N: P1.48 ; port FAT_PIPE1.Rx4_N
Rx4_P: P1.47 ; port FAT_PIPE1.Rx4_P
Rx5_N: P1.54 ; port FAT_PIPE1.Rx5_N
Rx5_P: P1.53 ; port FAT_PIPE1.Rx5_P
Rx6_N: P1.63 ; port FAT_PIPE1.Rx6_N
Rx6_P: P1.62 ; port FAT_PIPE1.Rx6_P
Rx7_N: P1.69 ; port FAT_PIPE1.Rx7_N
Rx7_P: P1.68 ; port FAT_PIPE1.Rx7_P
Rx8_N: P1.87 ; port FAT_PIPE2.Rx8_N
Rx8_P: P1.88 ; port FAT_PIPE2.Rx8_P
Rx9_N: P1.93 ; port FAT_PIPE2.Rx9_N
Rx9_P: P1.94 ; port FAT_PIPE2.Rx9_P
Rx10_N: P1.99 ; port FAT_PIPE2.Rx10_N
Rx10_P: P1.100 ; port FAT_PIPE2.Rx10_P
Rx11_N: P1.105 ; port FAT_PIPE2.Rx11_N
Rx11_P: P1.106 ; port FAT_PIPE2.Rx11_P
Rx12_N: P1.111 ; port AMC_P2P.Rx12_N
Rx12_P: P1.112 ; port AMC_P2P.Rx12_P
Rx13_N: P1.117 ; port AMC_P2P.Rx13_N
Rx13_P: P1.118 ; port AMC_P2P.Rx13_P
Rx14_N: P1.123 ; port AMC_P2P.Rx14_N
Rx14_P: P1.124 ; port AMC_P2P.Rx14_P
Rx15_N: P1.129 ; port AMC_P2P.Rx15_N
Rx15_P: P1.130 ; port AMC_P2P.Rx15_P
Rx17_N: P1.141 ; port MLVDS.Rx17_N
Rx17_P: P1.142 ; port MLVDS.Rx17_P
Rx18_N: P1.147 ; port MLVDS.Rx18_N
Rx18_P: P1.148 ; port MLVDS.Rx18_P
Rx19_N: P1.153 ; port MLVDS.Rx19_N
Rx19_P: P1.154 ; port MLVDS.Rx19_P
Rx20_N: P1.159 ; port MLVDS.Rx20_N
Rx20_P: P1.160 ; port MLVDS.Rx20_P
SCL_L: P1.56 ; port IPMB.SCL  [project net IPMB_SCL]
SDA_L: P1.71 ; port IPMB.SDA  [project net IPMB_SDA]
TCK: P1.165 ; port JTAG.TCK  [project net AMC_TCK]
TCLKA_N: P1.75 ; port TELECOM_CLK.TCLKA_N
TCLKA_P: P1.74 ; port TELECOM_CLK.TCLKA_P
TCLKB_N: P1.78 ; port TELECOM_CLK.TCLKB_N
TCLKB_P: P1.77 ; port TELECOM_CLK.TCLKB_P
TCLKC_N: P1.135 ; port TELECOM_CLK.TCLKC_N
TCLKC_P: P1.136 ; port TELECOM_CLK.TCLKC_P
TCLKD_N: P1.138 ; port TELECOM_CLK.TCLKD_N
TCLKD_P: P1.139 ; port TELECOM_CLK.TCLKD_P
TDI: P1.169 ; port JTAG.TDI  [project net AMC_TDI]
TDO: P1.168 ; port JTAG.TDO  [project net AMC_TDO]
TMS: P1.166 ; port JTAG.TMS  [project net AMC_TMS]
TRST#: P1.167 ; port JTAG.TRST#  [project net AMC_TRSTn]
TX0_N: P1.12 ; port PORT0.Tx0_N
TX0_P: P1.11 ; port PORT0.Tx0_P
TX1_N: P1.21 ; port PORT1.Tx1_N
TX1_P: P1.20 ; port PORT1.Tx1_P
Tx2_N: P1.30 ; port PORT2.Tx2_N
Tx2_P: P1.29 ; port PORT2.Tx2_P
Tx3_N: P1.36 ; port PORT3.Tx3_N
Tx3_P: P1.35 ; port PORT3.Tx3_P
Tx4_N: P1.45 ; port FAT_PIPE1.Tx4_N
Tx4_P: P1.44 ; port FAT_PIPE1.Tx4_P
Tx5_N: P1.51 ; port FAT_PIPE1.Tx5_N
Tx5_P: P1.50 ; port FAT_PIPE1.Tx5_P
Tx6_N: P1.60 ; port FAT_PIPE1.Tx6_N
Tx6_P: P1.59 ; port FAT_PIPE1.Tx6_P
Tx7_N: P1.66 ; port FAT_PIPE1.Tx7_N
Tx7_P: P1.65 ; port FAT_PIPE1.Tx7_P
Tx8_N: P1.90 ; port FAT_PIPE2.Tx8_N
Tx8_P: P1.91 ; port FAT_PIPE2.Tx8_P
Tx9_N: P1.96 ; port FAT_PIPE2.Tx9_N
Tx9_P: P1.97 ; port FAT_PIPE2.Tx9_P
Tx10_N: P1.102 ; port FAT_PIPE2.Tx10_N
Tx10_P: P1.103 ; port FAT_PIPE2.Tx10_P
Tx11_N: P1.108 ; port FAT_PIPE2.Tx11_N
Tx11_P: P1.109 ; port FAT_PIPE2.Tx11_P
Tx12_N: P1.114 ; port AMC_P2P.Tx12_N
Tx12_P: P1.115 ; port AMC_P2P.Tx12_P
Tx13_N: P1.120 ; port AMC_P2P.Tx13_N
Tx13_P: P1.121 ; port AMC_P2P.Tx13_P
Tx14_N: P1.126 ; port AMC_P2P.Tx14_N
Tx14_P: P1.127 ; port AMC_P2P.Tx14_P
Tx15_N: P1.132 ; port AMC_P2P.Tx15_N
Tx15_P: P1.133 ; port AMC_P2P.Tx15_P
Tx17_N: P1.144 ; port MLVDS.Tx17_N
Tx17_P: P1.145 ; port MLVDS.Tx17_P
Tx18_N: P1.150 ; port MLVDS.Tx18_N
Tx18_P: P1.151 ; port MLVDS.Tx18_P
Tx19_N: P1.156 ; port MLVDS.Tx19_N
Tx19_P: P1.157 ; port MLVDS.Tx19_P
Tx20_N: P1.162 ; port MLVDS.Tx20_N
Tx20_P: P1.163 ; port MLVDS.Tx20_P

Not connected (* = marked no-connect by the designer): P1 6* 8* 171* 172* 173* 174* 175* 176* 177* 178* 179* 180* 181* 182* 183* 184* 185* 186* 187* 188* 189* 190* 191* 192* 193* 194* 195* 196* 197* 198* 199* 200* 201* 202* 203* 204* 205* 206* 207* 208* 209* 210* 211* 212* 213* 214* 215* 216* 217* 218* 219* 220* 221* 222* 223* 224* 225* 226* 227* 228* 229* 230* 231* 232* 233* 234* 235* 236* 237* 238* 239* 240* 241* 242* 243* 244* 245* 246* 247* 248* 249* 250* 251* 252* 253* 254* 255* 256* 257* 258* 259* 260* 261* 262* 263* 264* 265* 266* 267* 268* 269* 270* 271* 272* 273* 274*

### Layout directives
differential pair: FCLKA_N, FCLKA_P, RX0_N, RX0_P, RX1_N, RX1_P, Rx2_N, Rx2_P, Rx3_N, Rx3_P, Rx4_N, Rx4_P, Rx5_N, Rx5_P, Rx6_N, Rx6_P, Rx7_N, Rx7_P, Rx8_N, Rx8_P, Rx9_N, Rx9_P, Rx10_N, Rx10_P, Rx11_N, Rx11_P, Rx12_N, Rx12_P, Rx13_N, Rx13_P, Rx14_N, Rx14_P, Rx15_N, Rx15_P, Rx17_N, Rx17_P, Rx18_N, Rx18_P, Rx19_N, Rx19_P, Rx20_N, Rx20_P, TCLKA_N, TCLKA_P, TCLKB_N, TCLKB_P, TCLKC_N, TCLKC_P, TCLKD_N, TCLKD_P, TX0_N, TX0_P, TX1_N, TX1_P, Tx2_N, Tx2_P, Tx3_N, Tx3_P, Tx4_N, Tx4_P, Tx5_N, Tx5_P, Tx6_N, Tx6_P, Tx7_N, Tx7_P, Tx8_N, Tx8_P, Tx9_N, Tx9_P, Tx10_N, Tx10_P, Tx11_N, Tx11_P, Tx12_N, Tx12_P, Tx13_N, Tx13_P, Tx14_N, Tx14_P, Tx15_N, Tx15_P, Tx17_N, Tx17_P, Tx18_N, Tx18_P, Tx19_N, Tx19_P, Tx20_N, Tx20_P

### Notes on the sheet
- RSRVD6
- RSRVD8
- NC
- P2P Signals - NOT USED
- - Dimensions are in MM, nominal values used
  - Component height rule derived from AMC Base Specification.PDF, Page 62
  - The two corners of outline near the edge-connector are approximated, see AMC Base Specification.PDF, Page 59
  - Stackup is not specified in AMC Base Specification.PDF or implemented in this template.
- Project/Equipment
- Document
- Designer
- Drawn by
- Check.by
- Copyright WUT ISE 2021
  This documentation describes Open Hardware and is licensed under CERN OHL v.1.1. You may redistribute and modify this documentaction under the terms of the CERN OHL v1.1.
  (http://ohwr.org/CERNOHL). This documentation is dristributed WITHOUT ANY EXPRESS OR IMPLIED WARRANTY, INCLUDING OF MERCHANTABLITY, SATISFACTORY QUALITY AND FITNESS FOR A PARTICULAR PURPOSE. Please see the CERN OHL v.1.1 for applicable conditions
- File
- Last Mod.
- Print Date
- Sheet
- Size
- A3
- of
- Rev
- Contact:

### Library data of the parts
D1 = BAT165: Schottky Diode; Manufacturer: INFINEON; Part Description: Medium Power AF Schottky Diode; Voltage: 40V; Power: 750mA; PressFit: No; Bonding: No; Manufacturer Part Number: BAT165; PackageDescription: Small Outline Diode (SOD-323), 1.70mm W X 1.25mm L X 1.10mm H body,  IPC Medium Density; Part Number: BAT165; Component Kind: Standard; Component Type: Standard; Device: BAT165; Pin Count: 2; Case: SOD323; Mounted: Yes; Socket: No; SMD: Yes; Sense: No; ComponentHeight: 1.1mm; HelpURL: \\cern.ch\dfs\Applications\Altium\Datasheets\BAT165.pdf; Author: CERN DEM JLC; CreateDate: 12.11.2014; LatestRevisionDate: 12.11.2014
P1 = CMP-0001-00058-2: Golden finger, AMC, Dual, Opposite, Pitch 0.75mm, 170-Position; Package Version: rev2.0, Nov-2006; Mating Connector: Molex-0758000001; Datasheet Version: rev2.0, Nov-2006; ClassName: Edge Connector; Package Reference: AMC-GF-2D-750-O274; Publisher: Altium